# EAGLE schematic warp-revC (EAGLE 9.4.2)

## Sheet 1 of 2
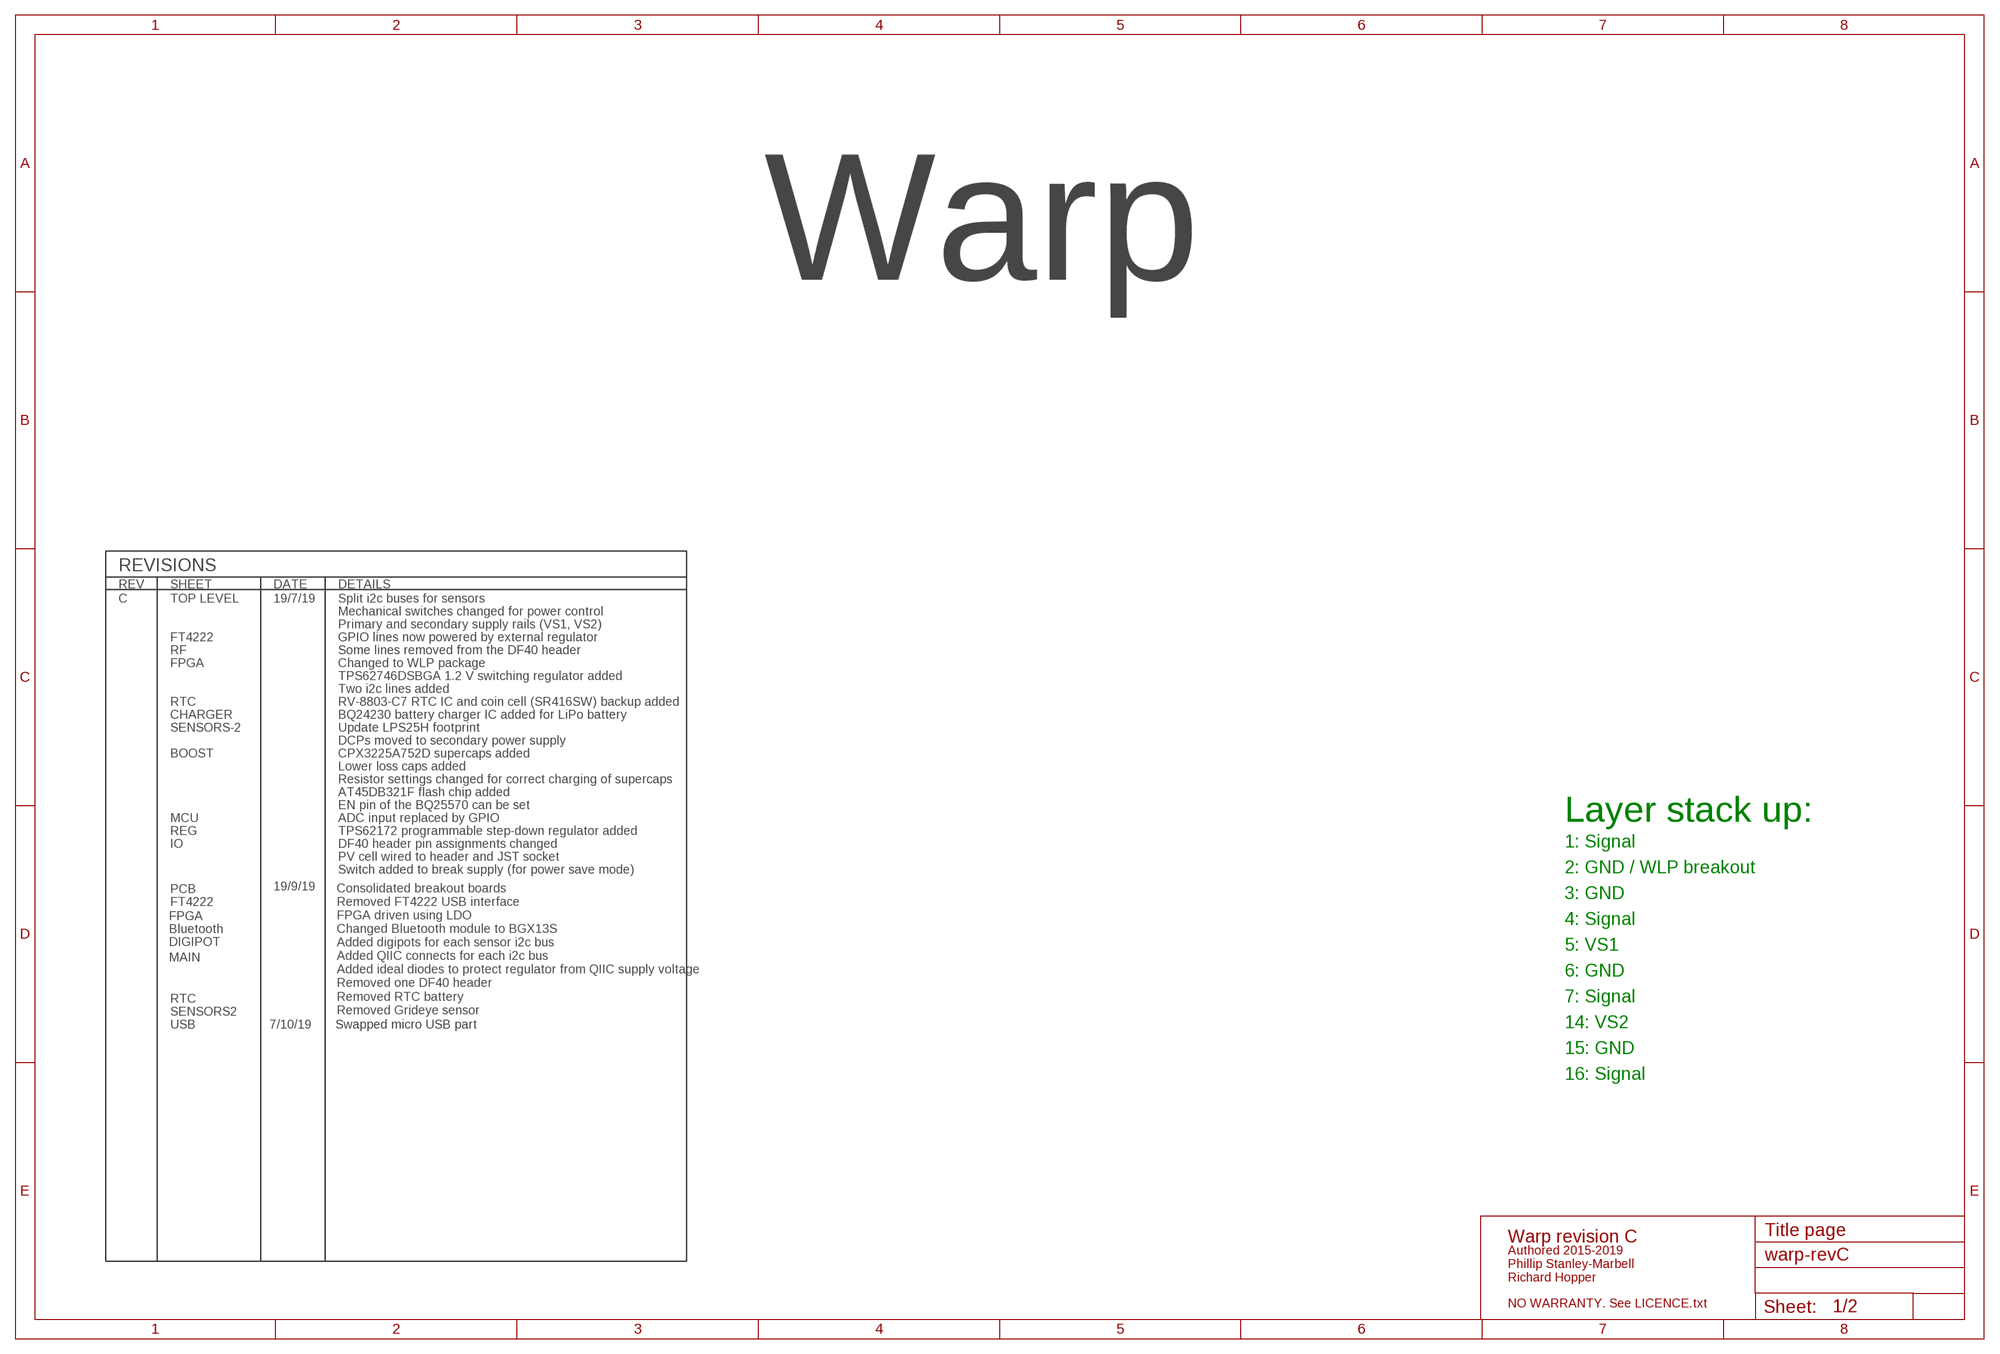
[diagram p0: schematic, sheet 1]

### Notes on the sheet
- Warp
- C | TOP LEVEL | 19/7/19 | Split i2c buses for sensors
- Mechanical switches changed for power control
- Primary and secondary supply rails (VS1, VS2)
- FT4222 | GPIO lines now powered by external regulator
- RF | Some lines removed from the DF40 header
- FPGA | Changed to WLP package
- TPS62746DSBGA 1.2 V switching regulator added
- Two i2c lines added
- RTC | RV-8803-C7 RTC IC and coin cell (SR416SW) backup added
- CHARGER | BQ24230 battery charger IC added for LiPo battery
- SENSORS-2 | Update LPS25H footprint
- DCPs moved to secondary power supply
- BOOST | CPX3225A752D supercaps added
- Lower loss caps added
- Resistor settings changed for correct charging of supercaps
- AT45DB321F flash chip added
- EN pin of the BQ25570 can be set
- MCU | ADC input replaced by GPIO | Layer stack up:
- REG | TPS62172 programmable step-down regulator added
- IO | DF40 header pin assignments changed | 1: Signal
- PV cell wired to header and JST socket
- Switch added to break supply (for power save mode) | 2: GND / WLP breakout
- PCB | 19/9/19
- 3: GND
- FT4222
- FPGA
- 4: Signal
- Bluetooth
- DIGIPOT
- 5: VS1
- MAIN
- 6: GND
- RTC | 7: Signal
- Consolidated breakout boards 
  Removed FT4222 USB interface 
  FPGA driven using LDO 
  Changed Bluetooth module to BGX13S 
  Added digipots for each sensor i2c bus 
  Added QIIC connects for each i2c bus 
  Added ideal diodes to protect regulator from QIIC supply voltage 
  Removed one DF40 header 
  Removed RTC battery 
  Removed Grideye sensor
- SENSORS2
- USB | 7/10/19 | Swapped micro USB part | 14: VS2
- 15: GND
- 16: Signal
- Title page
- Warp revision C
- Authored 2015-2019
  Phillip Stanley-Marbell
  Richard Hopper
- NO WARRANTY. See LICENCE.txt

## Sheet 2 of 2
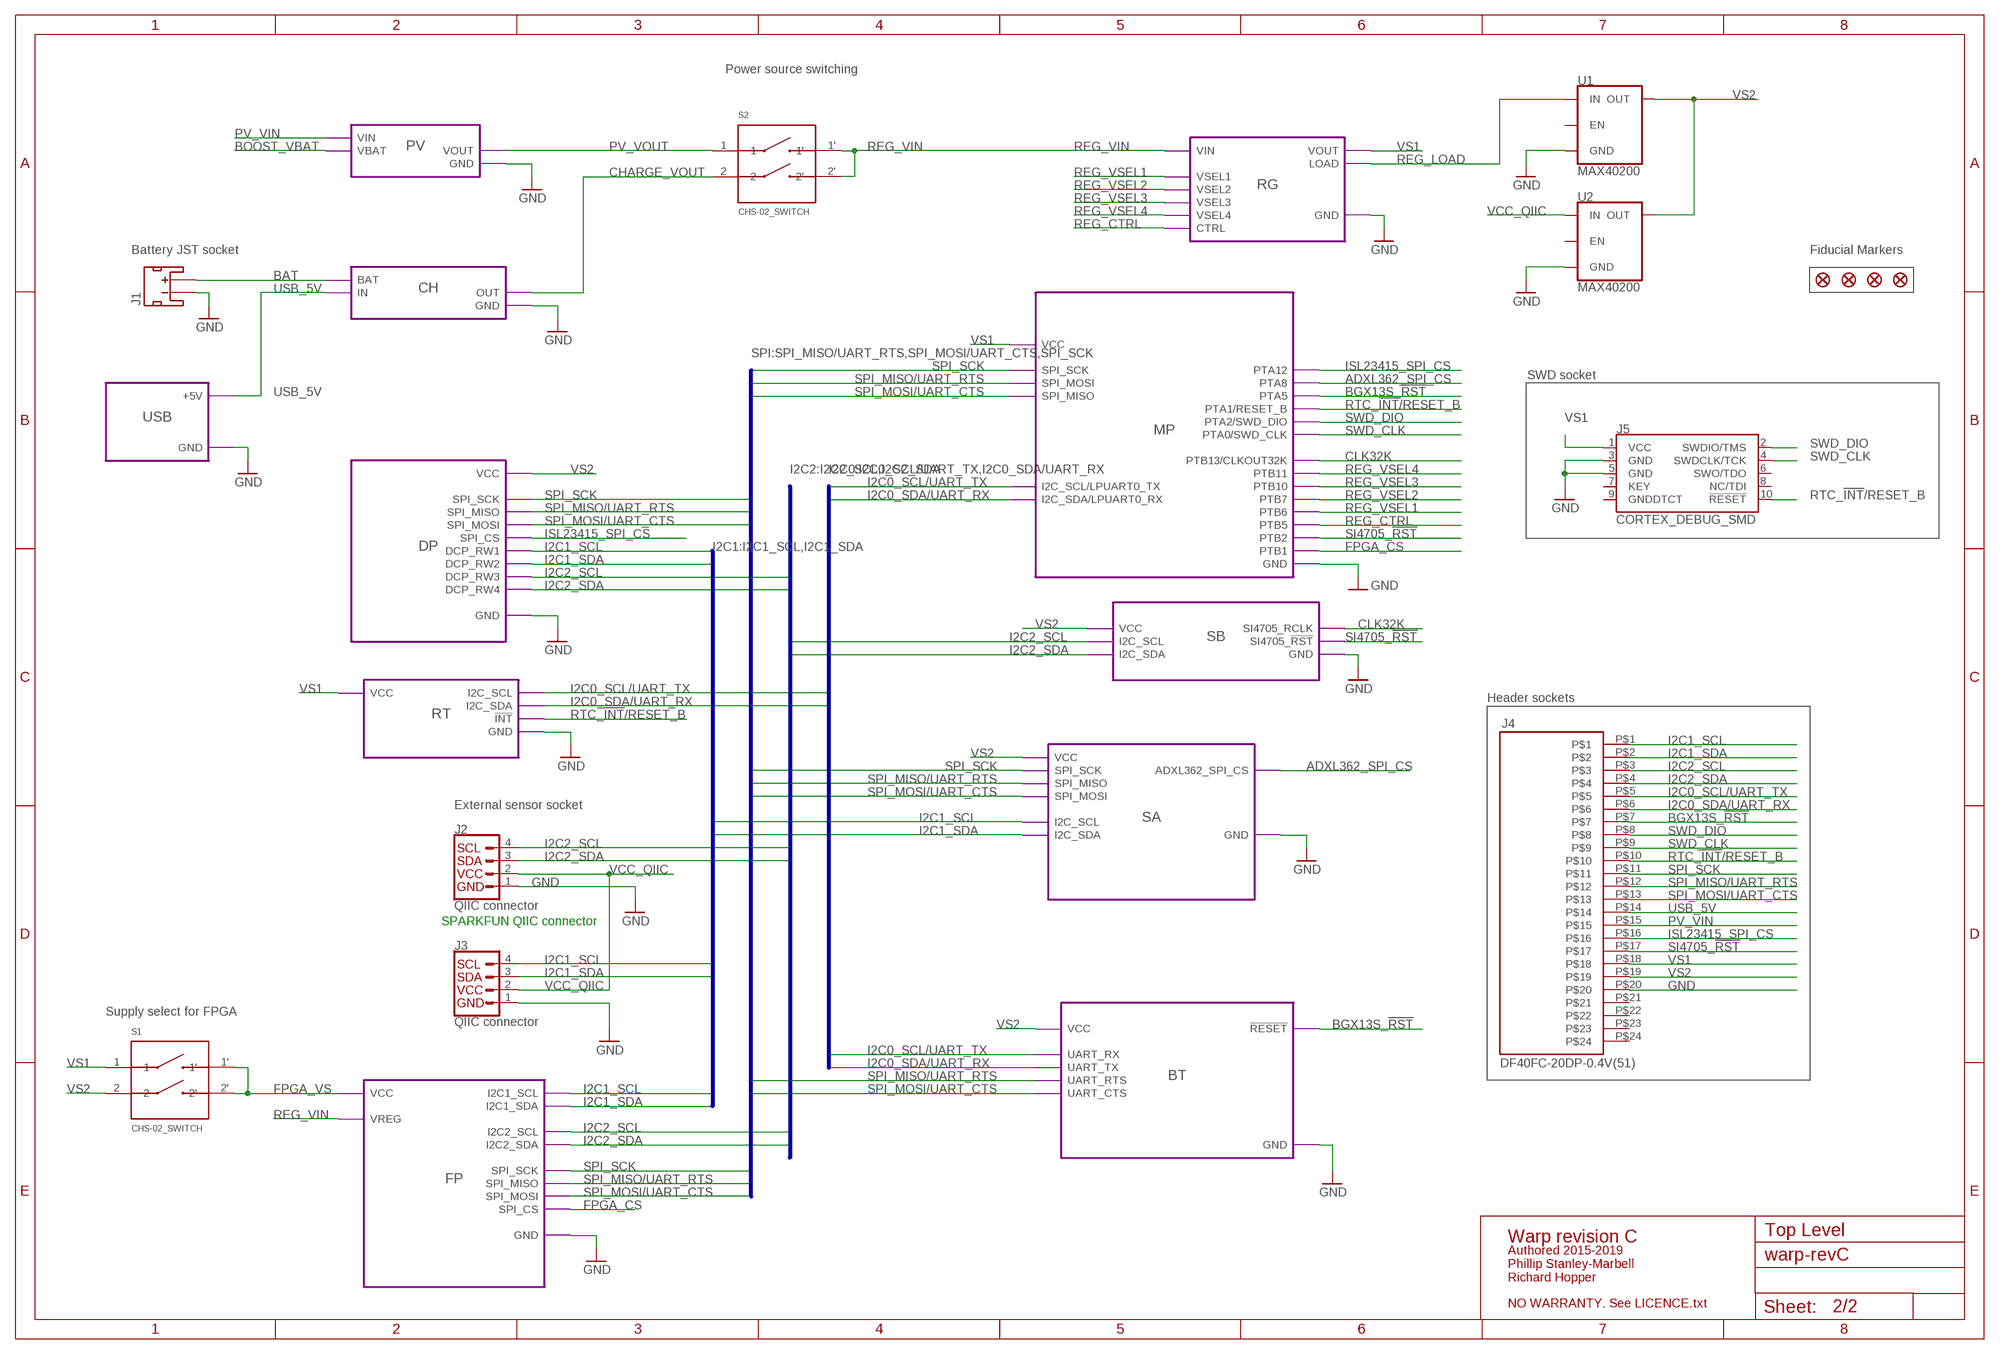
[diagram p1: schematic, sheet 2]

### Parts
FD1  FIDUCIAL1X2  [FIDUCIAL-1X2]
FD2  FIDUCIAL1X2  [FIDUCIAL-1X2]
FD3  FIDUCIAL1X2  [FIDUCIAL-1X2]
FD4  FIDUCIAL1X2  [FIDUCIAL-1X2]
J1  JST_2MM_MALE  [JST-2-SMD]
J2  QIIC connector  I2C_STANDARDJS-1MM  [1X04_1MM_RA]
J3  QIIC connector  I2C_STANDARDJS-1MM  [1X04_1MM_RA]
J4  DF40FC-20DP-0.4V(51)  [DF40C-20DP-0.4V(51)]
J5  CORTEX_DEBUG_SMD  [SAMTECH_FTSH-105-01]
S1  CHS-02_SWITCH  [CHS-02_SWITCH]
S2  CHS-02_SWITCH  [CHS-02_SWITCH]
U1  MAX40200  [DSBGA]
U2  MAX40200  [DSBGA]

### Module instances
PV = BOOSTER
MP = MPU
RG = REG
SA = SENSORS-1
FP = FPGA
SB = SENSORS-2
RT = RTC
CH = CHARGER
USB = USB
BT = BLUETOOTH
DP = DIGIPOT

### Nets
ADXL362_SPI_CS: port SA.ADXL362_SPI_CS MP.PTA8
BAT: J1.2(+) ; port CH.BAT
BGX13S_!RST: J4.P$7 ; port BT.!RESET MP.PTA5
BOOST_VBAT: port PV.VBAT
CHARGE_VOUT: S2.2 ; port CH.OUT
CLK32K: port MP.PTB13/CLKOUT32K SB.SI4705_RCLK
FPGA_CS: port FP.SPI_CS MP.PTB1
FPGA_VS: S1.1' S1.2' ; port FP.VCC
GND: J1.1(-) J2.1(GND) J3.1(GND) J4.P$20 J5.3(GND) J5.5(GND) U1.B2(GND) U2.B2(GND) ; port RG.GND PV.GND MP.GND SA.GND SB.GND FP.GND RT.GND CH.GND USB.GND BT.GND DP.GND
I2C0_SCL/UART_TX: J4.P$5 ; port MP.I2C_SCL/LPUART0_TX RT.I2C_SCL BT.UART_RX
I2C0_SDA/UART_RX: J4.P$6 ; port MP.I2C_SDA/LPUART0_RX RT.I2C_SDA BT.UART_TX
I2C1_SCL: J3.4(SCL) J4.P$1 ; port FP.I2C1_SCL SA.I2C_SCL DP.DCP_RW1
I2C1_SDA: J3.3(SDA) J4.P$2 ; port FP.I2C1_SDA SA.I2C_SDA DP.DCP_RW2
I2C2_SCL: J2.4(SCL) J4.P$3 ; port FP.I2C2_SCL DP.DCP_RW3 SB.I2C_SCL
I2C2_SDA: J2.3(SDA) J4.P$4 ; port FP.I2C2_SDA DP.DCP_RW4 SB.I2C_SDA
ISL23415_SPI_CS: J4.P$16 ; port MP.PTA12 DP.SPI_CS
PV_VIN: J4.P$15 ; port PV.VIN
PV_VOUT: S2.1 ; port PV.VOUT
REG_CTRL: port RG.CTRL MP.PTB5
REG_LOAD: U1.A1(IN) ; port RG.LOAD
REG_VIN: S2.1' S2.2' ; port RG.VIN FP.VREG
REG_VSEL1: port RG.VSEL1 MP.PTB6
REG_VSEL2: port RG.VSEL2 MP.PTB7
REG_VSEL3: port RG.VSEL3 MP.PTB10
REG_VSEL4: port RG.VSEL4 MP.PTB11
RTC_!INT!/RESET_B: J4.P$10 J5.10(!RESET) ; port MP.PTA1/RESET_B RT.!INT
SI4705_!RST: J4.P$17 ; port SB.SI4705_!RST MP.PTB2
SPI_MISO/UART_RTS: J4.P$12 ; port MP.SPI_MOSI SA.SPI_MISO FP.SPI_MISO BT.UART_RTS DP.SPI_MISO
SPI_MOSI/UART_CTS: J4.P$13 ; port SA.SPI_MOSI MP.SPI_MISO FP.SPI_MOSI BT.UART_CTS DP.SPI_MOSI
SPI_SCK: J4.P$11 ; port MP.SPI_SCK SA.SPI_SCK FP.SPI_SCK DP.SPI_SCK
SWD_CLK: J4.P$9 J5.4(SWDCLK/TCK) ; port MP.PTA0/SWD_CLK
SWD_DIO: J4.P$8 J5.2(SWDIO/TMS) ; port MP.PTA2/SWD_DIO
USB_5V: J4.P$14 ; port CH.IN USB.+5V
VCC_QIIC: J2.2(VCC) J3.2(VCC) U2.A1(IN)
VS1: J4.P$18 J5.1(VCC) S1.1 ; port MP.VCC RG.VOUT RT.VCC
VS2: J4.P$19 S1.2 U1.A2(OUT) U2.A2(OUT) ; port SA.VCC SB.VCC BT.VCC DP.VCC
Unconnected: J1.NC1(PAD1) J1.NC2(PAD2) J4.P$21 J4.P$22 J4.P$23 J4.P$24 J5.6(SWO/TDO) J5.7(KEY) J5.8(NC/TDI) J5.9(GNDDTCT) U1.B1(EN) U2.B1(EN)

### Buses
SPI:SPI_MISO/UART_RTS,SPI_MOSI/UART_CTS,SPI_SCK
I2C1:I2C1_SCL,I2C1_SDA
I2C2:I2C2_SCL,I2C2_SDA
I2C0:I2C0_SCL/UART_TX,I2C0_SDA/UART_RX

### Notes on the sheet
- Power source switching
- Battery JST socket | Fiducial Markers
- SWD socket
- Header sockets
- External sensor socket
- SPARKFUN QIIC connector
- Supply select for FPGA
- Top Level
- Warp revision C
- Authored 2015-2019
  Phillip Stanley-Marbell
  Richard Hopper
- NO WARRANTY. See LICENCE.txt

## Library data of the parts
FD1-FD4 = SparkFun-Aesthetics:FIDUCIAL: Fiducial Alignment Points Point-of-reference for pick-and-place machines and other optical instruments.
J1 = SparkFun-Connectors:JST_2MM_MALE: JST 2MM MALE RA CONNECTOR Two pin, compact surface mount connector. Commonly used as a battery input connection point. We really like the solid locking feeling and high current rating on these small connectors. We use these all the time as battery connectors. Mates to single-cell LiPo batteries. Here is the connector we sell at SparkFun: JST Right Angle Connector - White <https://www.sparkfun.com/products/8612> (PRT-08612) Datasheet <http://www.sparkfun.com/datasheets/Prototyping/Connectors/JST-Horizontal.pdf> It was used on these SparkFun products: SparkFun MOSFET Power Controller <https://www.sparkfun.com/products/11214> (PRT-11214) SparkFun Battery Babysitter - LiPo Battery Manager <https://www.sparkfun.com/products/13777> (PRT-13777) And many, many others that required a lipo battery connection.; PROD_ID: CONN-11443; SF_ID: PRT-08612
J2 J3 = SparkX:I2C_STANDARD: SparkFun I2C Standard Pinout Header SparkFun has standardized on a pinout for all I2C based sensor breakouts. This pinout allows I2C boards to be plugged directly into the headers on Arduino Uno compatible boards, and to be daisy chained easily. Example SparkFun Products: SparkFun Atmospheric Sensor Breakout - BME280 <https://www.sparkfun.com/products/13676> SparkFun Altitude/Pressure Sensor Breakout - MPL3115A2 <https://www.sparkfun.com/products/11084> SparkFun TOF Range Finder Sensor - VL6180 <https://www.sparkfun.com/products/12785>
J4 = DF40FC-20DP-0.4V(51):DF40FC-20DP-0.4V(51): DF40C-20DP-0.4V(51) Pins 21, 22, 23, and 24 (at the corners of the package) are not supposed to be used electrically. They have slightly wider pads. NOTE: The receptacles do not have connectors to the signals from these pins!
J5 = SparkFun-Connectors:CORTEX_DEBUG: Cortex Debug Connector - 10 pin Supports JTAG debug, Serial Wire debug, and Serial Wire Viewer. PTH and SMD connector options available. General Connector Information <http://infocenter.arm.com/help/topic/com.arm.doc.faqs/attached/13634/cortex_debug_connectors.pdf> Products: PTH Connector <http://www.digikey.com/product-detail/en/cnc-tech/3220-10-0100-00/1175-1627-ND/3883661> -via Digi-Key SparkFun PSoc <https://www.sparkfun.com/products/13229> SparkFun T <https://www.sparkfun.com/products/13810>
S1 S2 = CHS_SWITCH:CHS-02_SWITCH
U1 U2 = MAX40200:MAX40200

## Module BOOSTER
Ports: VIN(pwr) VOUT(pwr) VBAT(pwr) GND(pwr)
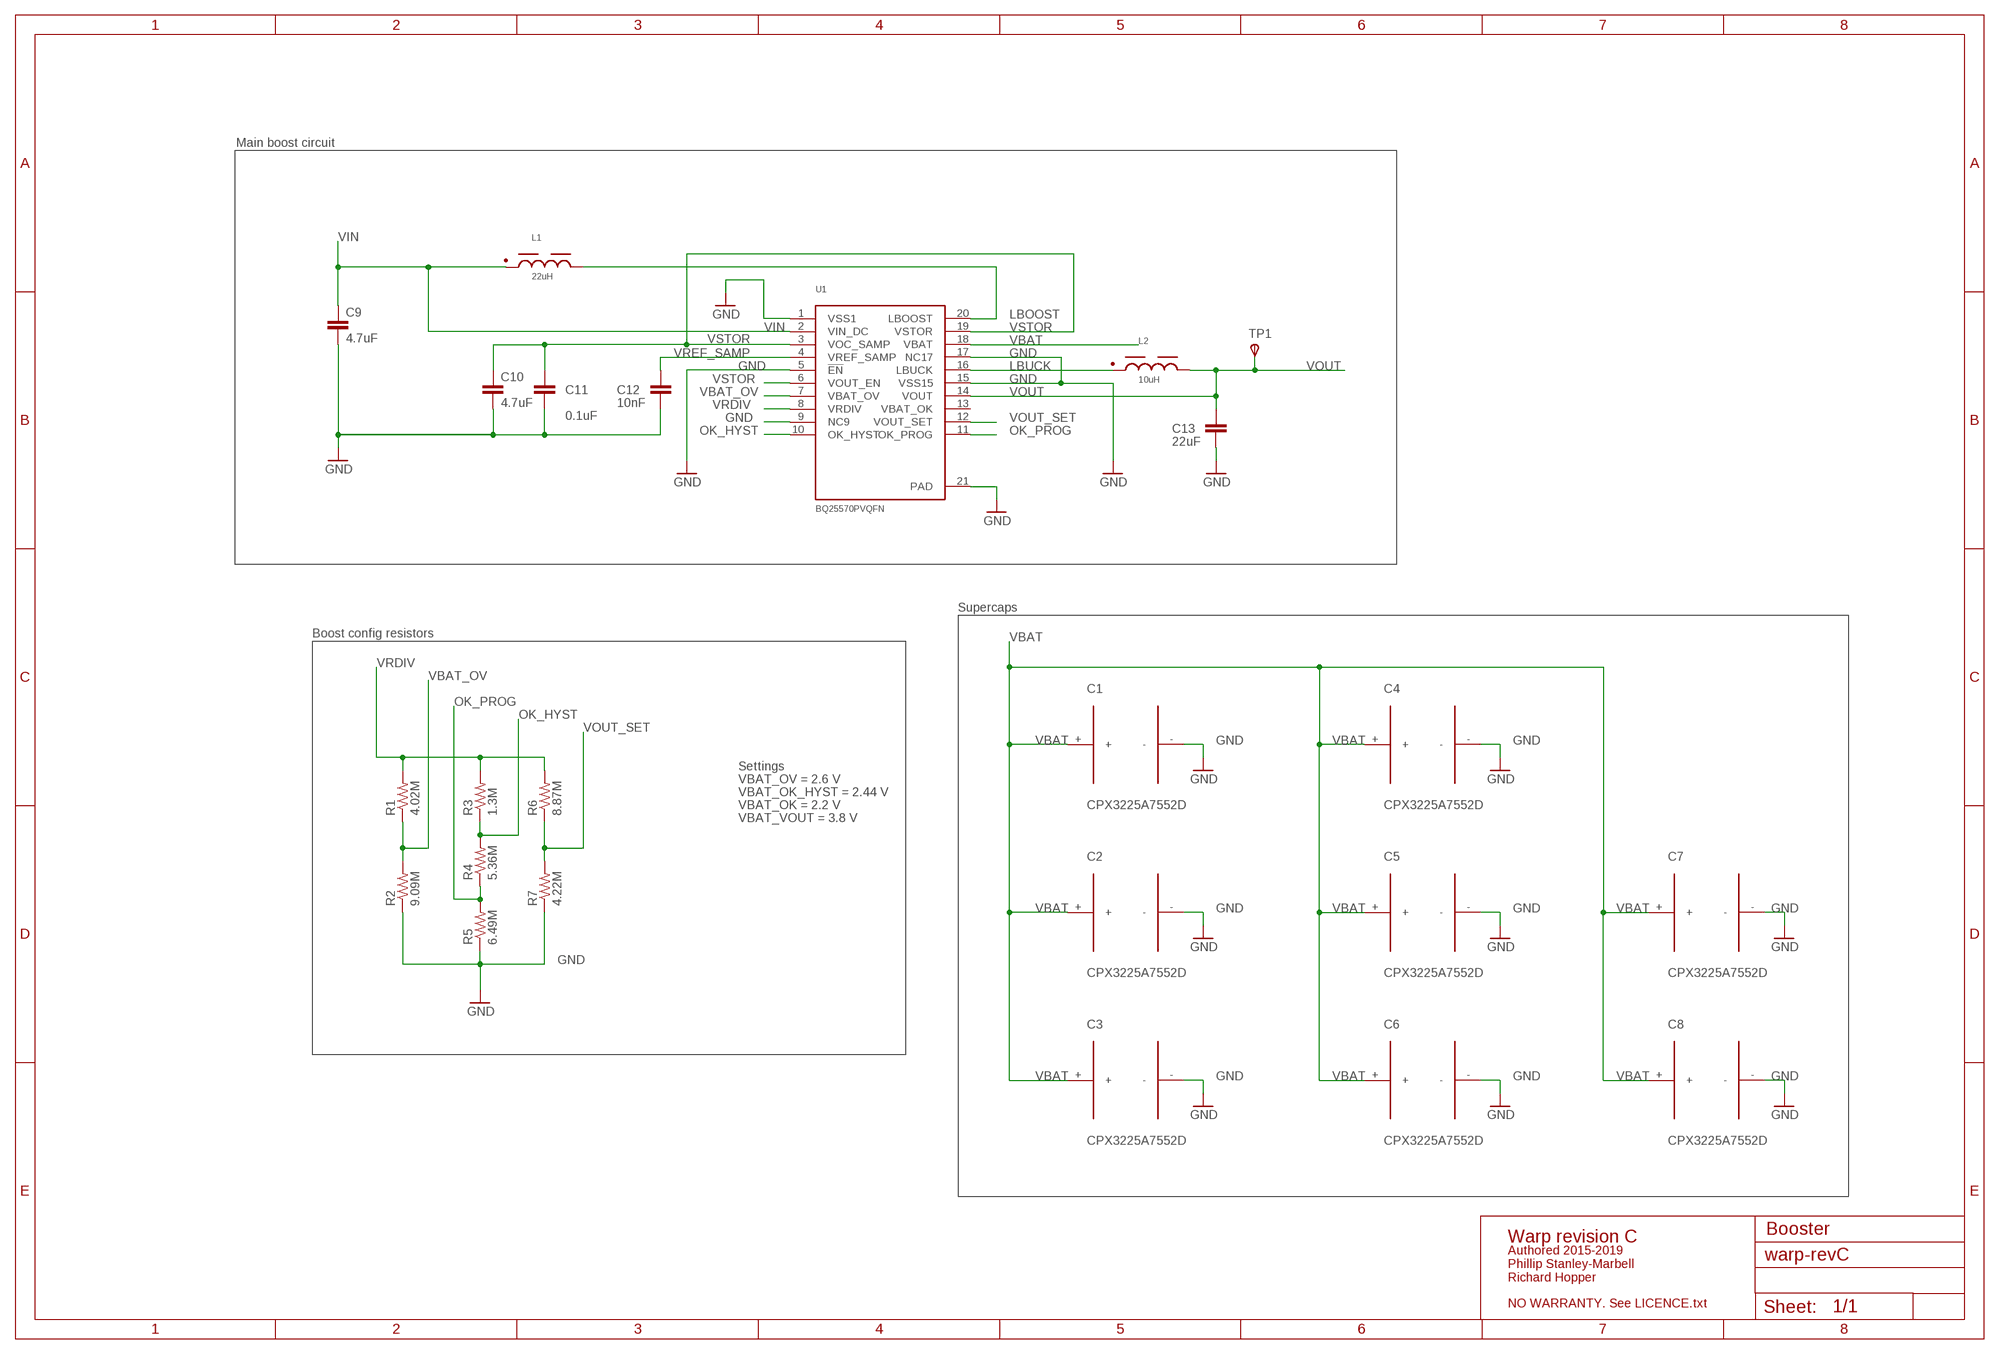
[diagram p2: schematic, module BOOSTER, sheet 1]

### Parts
C1  CPX3225A7552D  [CPX3225A752D]
C2  CPX3225A7552D  [CPX3225A752D]
C3  CPX3225A7552D  [CPX3225A752D]
C4  CPX3225A7552D  [CPX3225A752D]
C5  CPX3225A7552D  [CPX3225A752D]
C6  CPX3225A7552D  [CPX3225A752D]
C7  CPX3225A7552D  [CPX3225A752D]
C8  CPX3225A7552D  [CPX3225A752D]
C9  4.7uF  CAP0805  [0805]
C10  4.7uF  CAP0805  [0805]
C11  0.1uF  CAP0603-CAP  [0603-CAP]
C12  10nF  CAP0603-CAP  [0603-CAP]
C13  22uF  CAP0805  [0805]
L1  22uH  WE-TPC_3816_744031220  [WE-TPC_3816]
L2  10uH  WE-TPC_2813_744029100  [WE-TPC_2811/2813_OLD]
R1  4.02M  RESISTOR0402-RES  [0402-RES]
R2  9.09M  RESISTOR0402-RES  [0402-RES]
R3  1.3M  RESISTOR0402-RES  [0402-RES]
R4  5.36M  RESISTOR0402-RES  [0402-RES]
R5  6.49M  RESISTOR0402-RES  [0402-RES]
R6  8.87M  RESISTOR0402-RES  [0402-RES]
R7  4.22M  RESISTOR0402-RES  [0402-RES]
TP1  TPSTP06R  [TP06R]
U1  BQ25570PVQFN  [BQ25570]

### Nets
GND: C1.- C2.- C3.- C4.- C5.- C6.- C7.- C8.- C9.2 C10.2 C11.2 C12.2 C13.2 R2.1 R5.1 R7.1 U1.1(VSS1) U1.5(!EN) U1.9(NC9) U1.15(VSS15) U1.17(NC17) U1.21(PAD)
LBOOST: L1.2 U1.20(LBOOST)
LBUCK: L2.1 U1.16(LBUCK)
OK_HYST: R3.1 R4.2 U1.10(OK_HYST)
OK_PROG: R4.1 R5.2 U1.11(OK_PROG)
VBAT: C1.+ C2.+ C3.+ C4.+ C5.+ C6.+ C7.+ C8.+ U1.18(VBAT)
VBAT_OV: R1.1 R2.2 U1.7(VBAT_OV)
VIN: C9.1 L1.1 U1.2(VIN_DC)
VOUT: C13.1 L2.2 TP1.TP(PP) U1.14(VOUT)
VOUT_SET: R6.1 R7.2 U1.12(VOUT_SET)
VRDIV: R1.2 R3.2 R6.2 U1.8(VRDIV)
VREF_SAMP: C12.1 U1.4(VREF_SAMP)
VSTOR: C10.1 C11.1 U1.3(VOC_SAMP) U1.6(VOUT_EN) U1.19(VSTOR)
Unconnected: U1.13(VBAT_OK)

### Notes on the sheet
- Main boost circuit
- Supercaps
- Boost config resistors
- Settings
- VBAT_OV = 2.6 V
- VBAT_OK_HYST = 2.44 V
- VBAT_OK = 2.2 V
- VBAT_VOUT = 3.8 V
- Booster
- Warp revision C
- Authored 2015-2019
  Phillip Stanley-Marbell
  Richard Hopper
- NO WARRANTY. See LICENCE.txt

### Library data of the parts
C1-C7 = CPX3225A752D:CPX3225A7552D: CPX3225A eectric double layer capacitor
C8 = CPX3225A752D:CPX3225A7552D: CPX3225A eectric double layer capacitor; SPICEPREFIX: C
C9 C10 = SparkFun-Passives:CAP: Capacitor Standard 0603 ceramic capacitor, and 0.1" leaded capacitor.; PN: C0805C475K9RACTU
C11 = SparkFun-Passives:CAP: Capacitor Standard 0603 ceramic capacitor, and 0.1" leaded capacitor.; PN: 02016D104KAT2A
C12 = SparkFun-Passives:CAP: Capacitor Standard 0603 ceramic capacitor, and 0.1" leaded capacitor.; PN: GRM188R71H103KA01D
C13 = SparkFun-Passives:CAP: Capacitor Standard 0603 ceramic capacitor, and 0.1" leaded capacitor.; PN: JMK212BJ226KG-T
L1 = EMCComponents (rev19c):WE-TPC_3816: SMD Shielded Tiny Power Inductor Characteristics Extremely flat power inductor High current capability Magnetically shielded which results in a low leakage field Operating temperature: –40 °C to +125 °C Applications Portable power like PDA, digital camera, PCMCIA cards and displays DC/DC converter Embedded PC Mobile data gathering, telemetric <http://katalog.we-online.de/media/images/v2/WE-TPC_Gruppe_2.jpg> Details see: http://katalog.we-online.de/en/pbs/WE-TPC? Updated by Dan Xu 2014-07-11 2014 (C) Wurth Elektronik; WE-NUMBER: 744031220/22uH
L2 = EMCComponents (rev19c):WE-TPC_2813: SMD Shielded Tiny Power Inductor Characteristics Extremely flat power inductor High current capability Magnetically shielded which results in a low leakage field Operating temperature: –40 °C to +125 °C Applications Portable power like PDA, digital camera, PCMCIA cards and displays DC/DC converter Embedded PC Mobile data gathering, telemetric <http://katalog.we-online.de/media/images/v2/WE-TPC_Gruppe_2.jpg> Details see: http://katalog.we-online.de/en/pbs/WE-TPC? Updated by Dan Xu 2014-07-11 2014 (C) Wurth Elektronik; WE-NUMBER: 744029100/10uH
R1-R7 = SparkFun-Passives:RESISTOR: Resistor Basic schematic elements and footprints for 0603, 1206, and PTH resistors.
TP1 = testpad:TPS: TEST PIN
U1 = BQ25570:BQ25570

## Module MPU
Ports: GND(pwr) VCC(pwr) PTB1(io) PTB2(io) PTB5(io) PTB6(io) PTB7(io) PTA8(io) PTA5(io) PTB10(io) PTA12(io) PTB11(io) PTB13/CLKOUT32K(io) SPI_SCK(out) SPI_MISO(io) SPI_MOSI(out) I2C_SCL/LPUART0_TX(out) I2C_SDA/LPUART0_RX(io) PTA1/RESET_B(io) PTA2/SWD_DIO(io) PTA0/SWD_CLK(io)
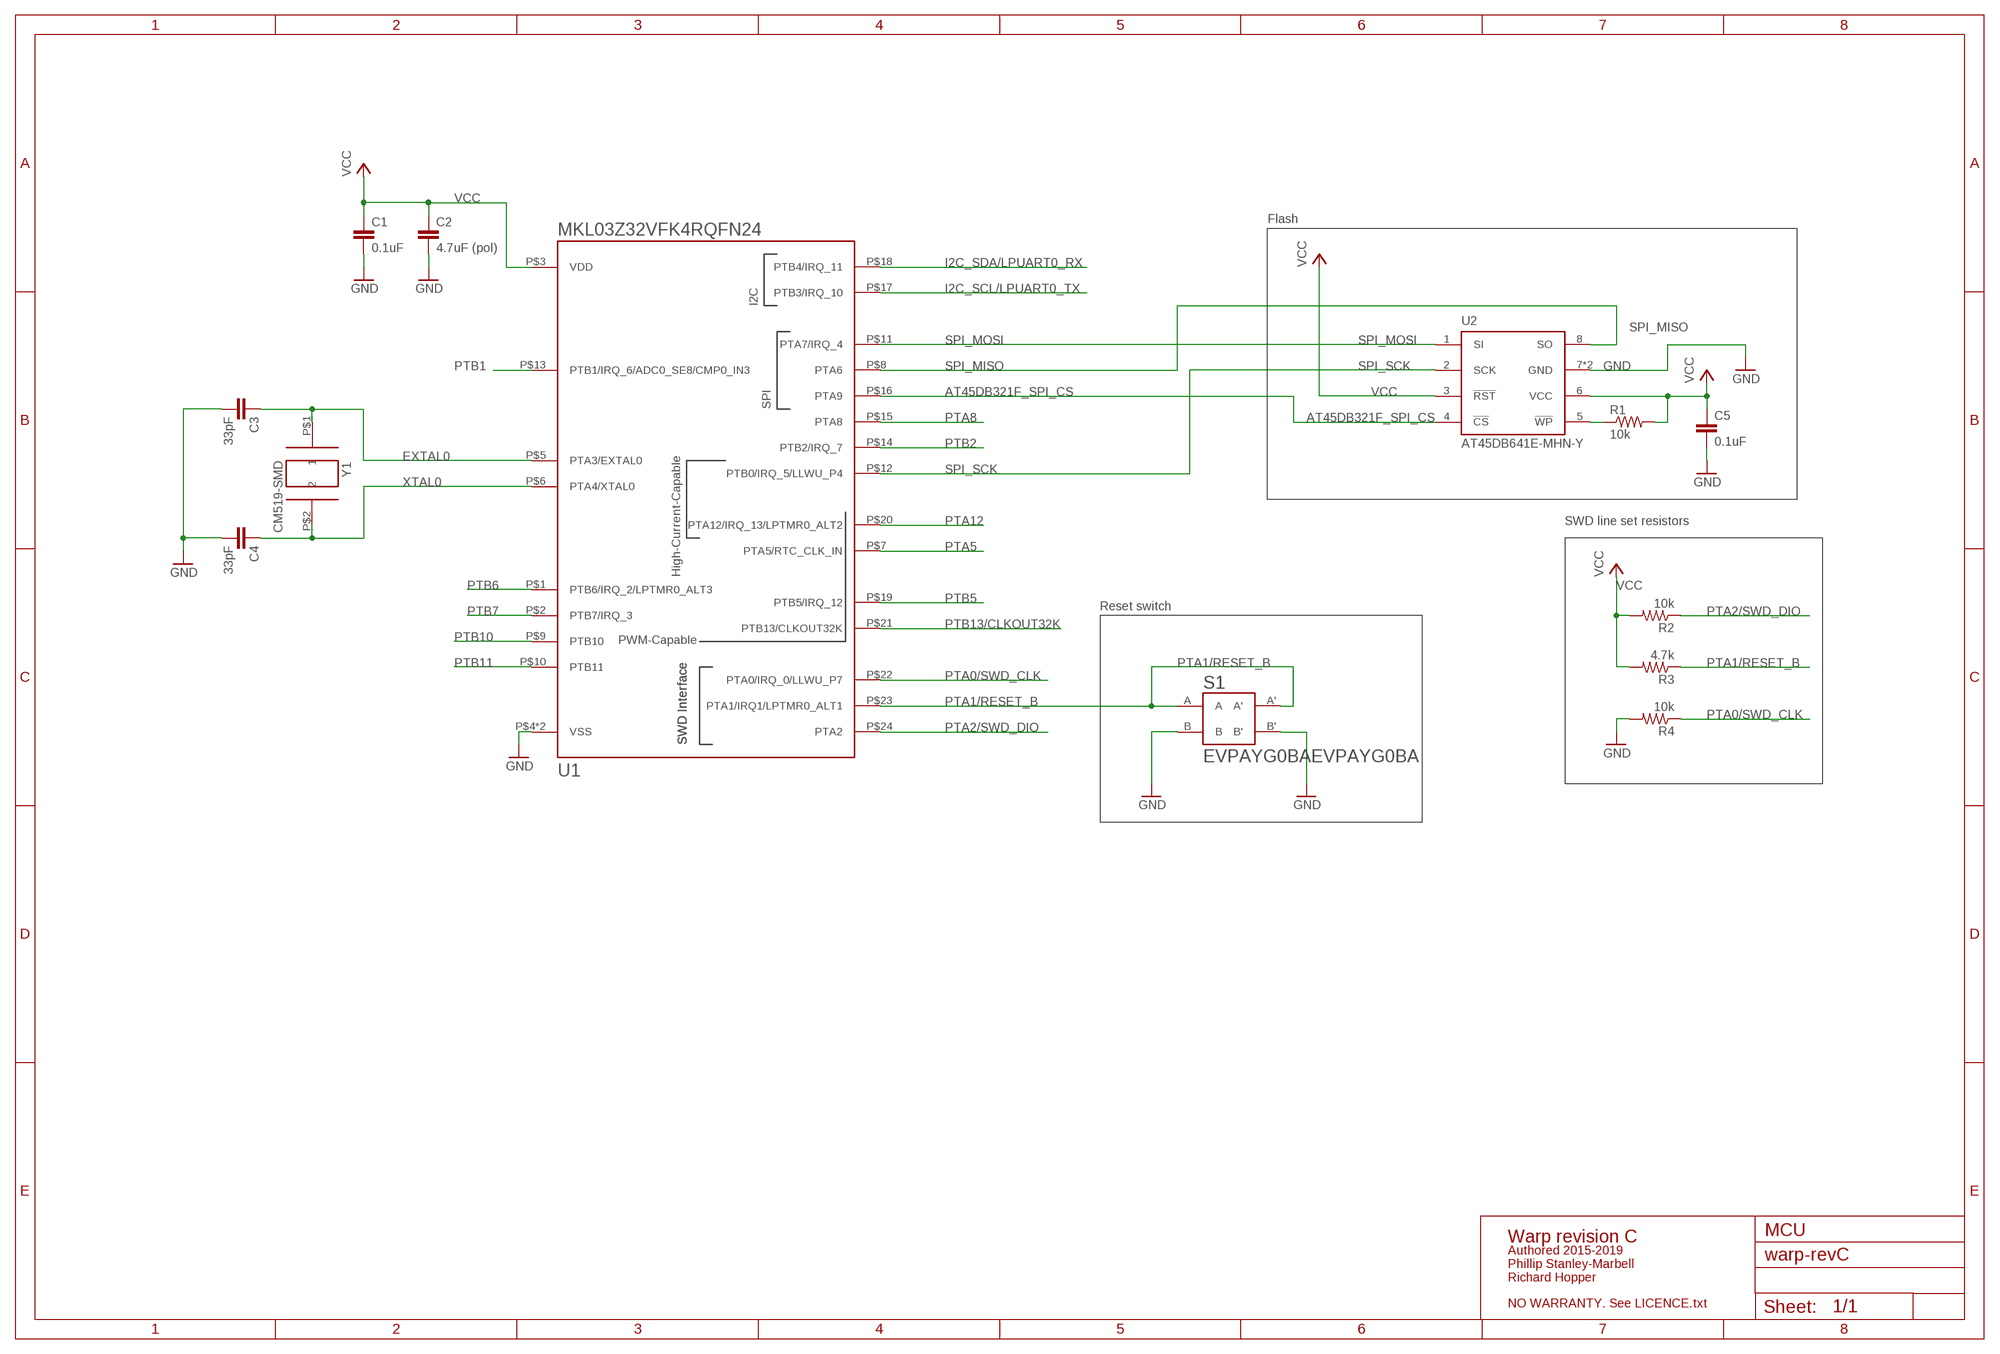
[diagram p3: schematic, module MPU, sheet 1]

### Parts
C1  0.1uF  CAP0402-CAP  [0402-CAP]
C2  4.7uF (pol)  CAP0402-CAP  [0402-CAP]
C3  33pF  CAP0402-CAP  [0402-CAP]
C4  33pF  CAP0402-CAP  [0402-CAP]
C5  0.1uF  CAP0402-CAP  [0402-CAP]
R1  10k  RESISTOR0402-RES  [0402-RES]
R2  10k  RESISTOR0402-RES  [0402-RES]
R3  4.7k  RESISTOR0402-RES  [0402-RES]
R4  10k  RESISTOR0402-RES  [0402-RES]
S1  EVPAYG0BAEVPAYG0BA  [EVPAYG0BA]
U1  MKL03Z32VFK4RQFN24  [MKL03Z32VFK4R]
U2  AT45DB641E-MHN-Y  [UDFN]
Y1  CM519-SMD  [CM519]

### Nets
AT45DB321F_SPI_CS: U1.P$16(PTA9) U2.4(!CS!)
EXTAL0: C3.1 U1.P$5(PTA3/EXTAL0) Y1.P$1
GND: C1.2 C2.2 C3.2 C4.2 C5.2 R4.2 S1.B S1.B' U1.P$4(VSS) U1.P$PAD(VSS) U2.7(GND) U2.9(GND)
I2C_SCL/LPUART0_TX: U1.P$17(PTB3/IRQ_10)
I2C_SDA/LPUART0_RX: U1.P$18(PTB4/IRQ_11)
N$4: R1.1 U2.5(!WP!)
PTA0/SWD_CLK: R4.1 U1.P$22(PTA0/IRQ_0/LLWU_P7)
PTA1/RESET_B: R3.1 S1.A S1.A' U1.P$23(PTA1/IRQ1/LPTMR0_ALT1)
PTA2/SWD_DIO: R2.1 U1.P$24(PTA2)
PTA5: U1.P$7(PTA5/RTC_CLK_IN)
PTA8: U1.P$15(PTA8)
PTA12: U1.P$20(PTA12/IRQ_13/LPTMR0_ALT2)
PTB1: U1.P$13(PTB1/IRQ_6/ADC0_SE8/CMP0_IN3)
PTB2: U1.P$14(PTB2/IRQ_7)
PTB5: U1.P$19(PTB5/IRQ_12)
PTB6: U1.P$1(PTB6/IRQ_2/LPTMR0_ALT3)
PTB7: U1.P$2(PTB7/IRQ_3)
PTB10: U1.P$9(PTB10)
PTB11: U1.P$10(PTB11)
PTB13/CLKOUT32K: U1.P$21(PTB13/CLKOUT32K)
SPI_MISO: U1.P$8(PTA6) U2.8(SO)
SPI_MOSI: U1.P$11(PTA7/IRQ_4) U2.1(SI)
SPI_SCK: U1.P$12(PTB0/IRQ_5/LLWU_P4) U2.2(SCK)
VCC: C1.1 C2.1 C5.1 R1.2 R2.2 R3.2 U1.P$3(VDD) U2.3(!RST!) U2.6(VCC)
XTAL0: C4.1 U1.P$6(PTA4/XTAL0) Y1.P$2

### Notes on the sheet
- Flash
- SWD line set resistors
- Reset switch
- MCU
- Warp revision C
- Authored 2015-2019
  Phillip Stanley-Marbell
  Richard Hopper
- NO WARRANTY. See LICENCE.txt

### Library data of the parts
C1-C5 = SparkFun-Passives:CAP: Capacitor Standard 0603 ceramic capacitor, and 0.1" leaded capacitor.
R1-R4 = SparkFun-Passives:RESISTOR: Resistor Basic schematic elements and footprints for 0603, 1206, and PTH resistors.
S1 = EVPAYG0BA:EVPAYG0BA
U1 = MKL03Z32VFK4R:MKL03Z32VFK4R: Kinetis KL03 32 KB Flash, 48 MHz Cortex-M0+ Microcontroller, in 24 pin QFN package (MKL03Z32VFK4R). The package for the 20 pin WLCSP (MKL03Z32CAF4R) is also in the library due to historical reasons. Can't yet figure out how to remove it.
U2 = AT45D_Flash:AT45DB641E-MHN-Y: AT45DB321FLow-Power 32 Mbit, 1.65V - 3.6V SPI Serial DataFlashMemory with 512/528 Byte Page Size
Y1 = CM519:CM519

## Module REG
Ports: GND(pwr) VIN(pwr) VOUT(pwr) LOAD(pwr) CTRL(in) VSEL1(in) VSEL2(in) VSEL3(in) VSEL4(in)
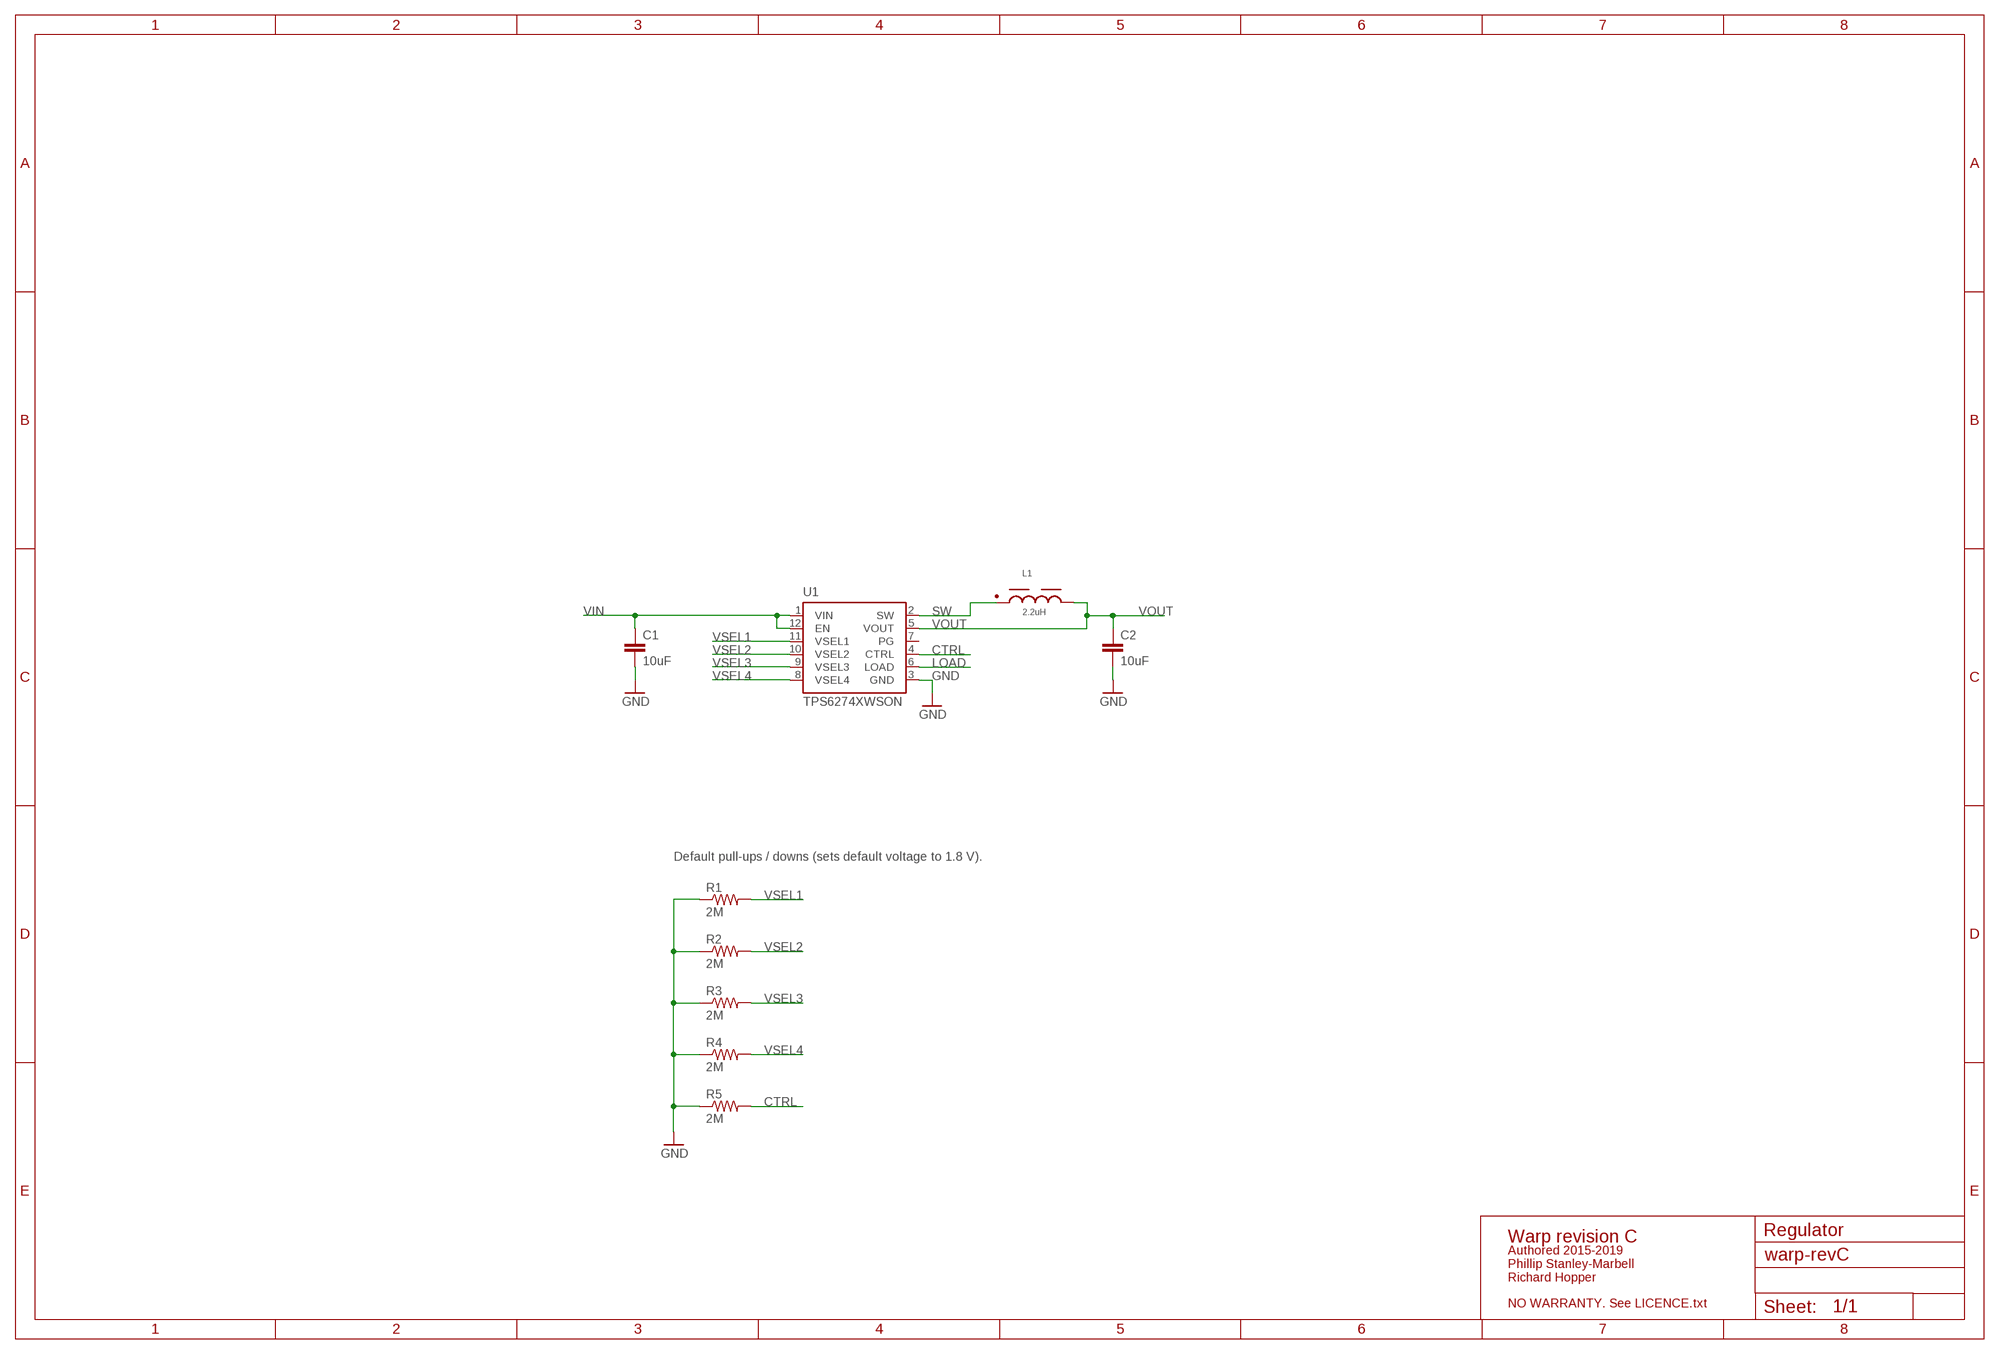
[diagram p4: schematic, module REG, sheet 1]

### Parts
C1  10uF  CAP0805  [0805]
C2  10uF  CAP0805  [0805]
L1  2.2uH  WE-TPC_2828_744025002  [WE-TPC_2828_OLD]
R1  2M  RESISTOR0402-RES  [0402-RES]
R2  2M  RESISTOR0402-RES  [0402-RES]
R3  2M  RESISTOR0402-RES  [0402-RES]
R4  2M  RESISTOR0402-RES  [0402-RES]
R5  2M  RESISTOR0402-RES  [0402-RES]
U1  TPS6274XWSON  [WSON-12]

### Nets
CTRL: R5.2 U1.4(CTRL)
GND: C1.2 C2.2 R1.1 R2.1 R3.1 R4.1 R5.1 U1.3(GND)
LOAD: U1.6(LOAD)
SW: L1.1 U1.2(SW)
VIN: C1.1 U1.1(VIN) U1.12(EN)
VOUT: C2.1 L1.2 U1.5(VOUT)
VSEL1: R1.2 U1.11(VSEL1)
VSEL2: R2.2 U1.10(VSEL2)
VSEL3: R3.2 U1.9(VSEL3)
VSEL4: R4.2 U1.8(VSEL4)
Unconnected: U1.7(PG)

### Notes on the sheet
- Default pull-ups / downs (sets default voltage to 1.8 V).
- Regulator
- Warp revision C
- Authored 2015-2019
  Phillip Stanley-Marbell
  Richard Hopper
- NO WARRANTY. See LICENCE.txt

### Library data of the parts
C1 C2 = SparkFun-Passives:CAP: Capacitor Standard 0603 ceramic capacitor, and 0.1" leaded capacitor.
L1 = EMCComponents (rev19c):WE-TPC_2828: SMD Shielded Tiny Power Inductor Characteristics Extremely flat power inductor High current capability Magnetically shielded which results in a low leakage field Operating temperature: –40 °C to +125 °C Applications Portable power like PDA, digital camera, PCMCIA cards and displays DC/DC converter Embedded PC Mobile data gathering, telemetric <http://katalog.we-online.de/media/images/v2/WE-TPC_Gruppe_2.jpg> Details see: http://katalog.we-online.de/en/pbs/WE-TPC? Updated by Dan Xu 2014-07-11 2014 (C) Wurth Elektronik; WE-NUMBER: 744025002/2,2uH
R1-R5 = SparkFun-Passives:RESISTOR: Resistor Basic schematic elements and footprints for 0603, 1206, and PTH resistors.
U1 = TPS6274x:TPS6274X

## Module BLUETOOTH
Ports: GND(pwr) VCC(pwr) UART_RX(in) UART_TX(out) UART_CTS(io) UART_RTS(io) !RESET(in)
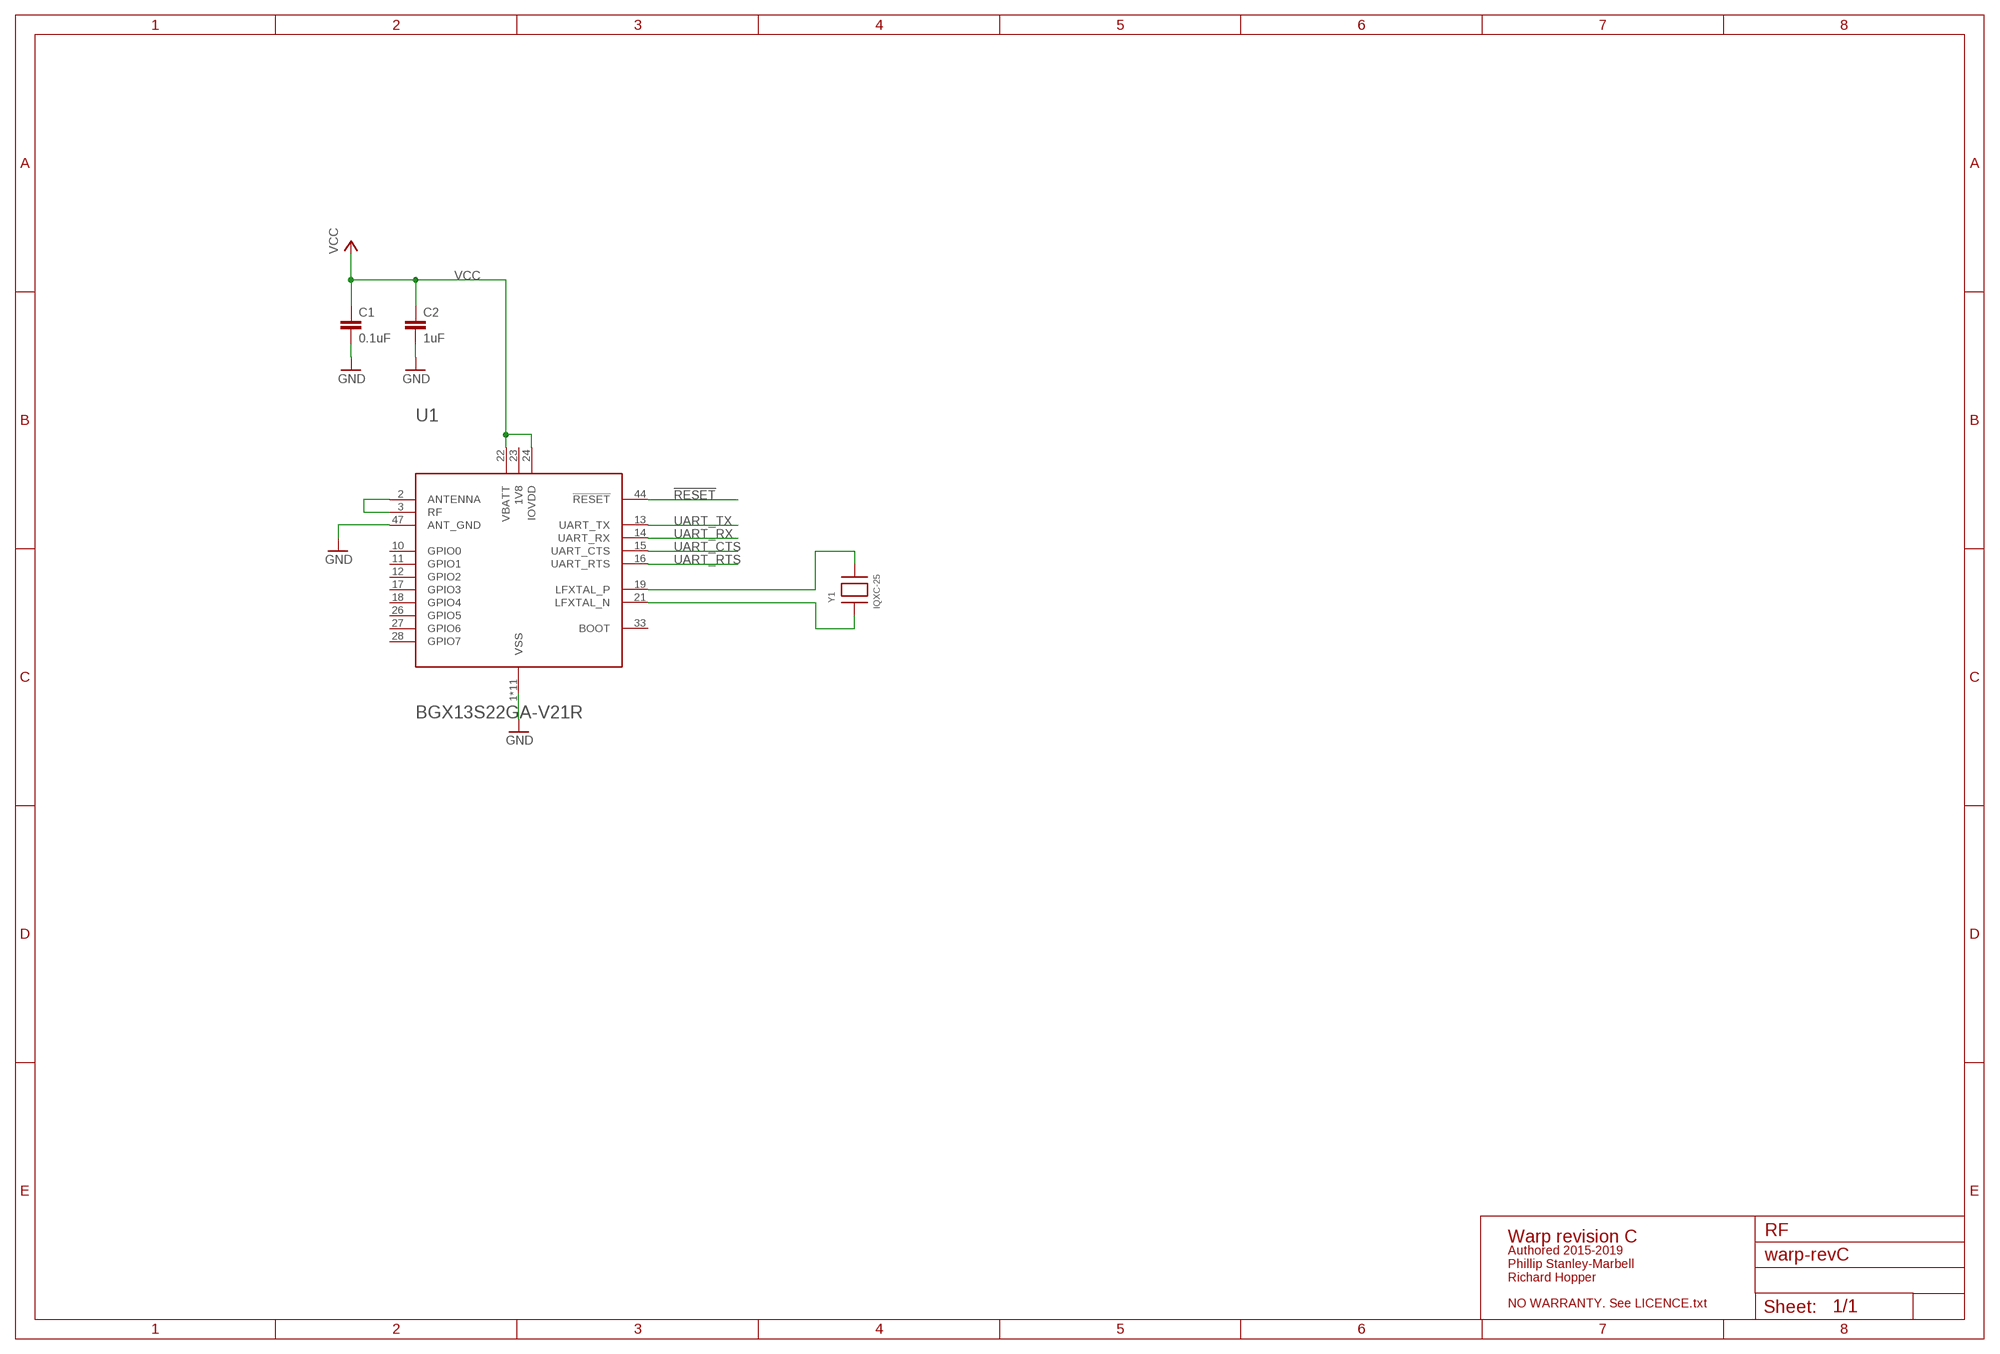
[diagram p5: schematic, module BLUETOOTH, sheet 1]

### Parts
C1  0.1uF  CAP0402-CAP  [0402-CAP]
C2  1uF  CAP0402-CAP  [0402-CAP]
U1  BGX13S22GA-V21R  [BGX13S]
Y1  IQXC-25  [IQXC-25]

### Nets
!RESET: U1.44(!RESET)
GND: C1.2 C2.2 U1.1(VSS) U1.4(VSS) U1.5(VSS) U1.20(VSS) U1.31(VSS) U1.45(VSS) U1.46(VSS) U1.47(ANT_GND) U1.48(VSS) U1.49(VSS) U1.50(VSS) U1.51(VSS)
N$1: U1.21(LFXTAL_N) Y1.1
N$2: U1.19(LFXTAL_P) Y1.2
N$3: U1.2(ANTENNA) U1.3(RF)
UART_CTS: U1.15(UART_CTS)
UART_RTS: U1.16(UART_RTS)
UART_RX: U1.14(UART_RX)
UART_TX: U1.13(UART_TX)
VCC: C1.1 C2.1 U1.22(VBATT) U1.24(IOVDD)
Unconnected: U1.10(GPIO0) U1.11(GPIO1) U1.12(GPIO2) U1.17(GPIO3) U1.18(GPIO4) U1.23(1V8) U1.26(GPIO5) U1.27(GPIO6) U1.28(GPIO7) U1.33(BOOT)

### Notes on the sheet
- RF
- Warp revision C
- Authored 2015-2019
  Phillip Stanley-Marbell
  Richard Hopper
- NO WARRANTY. See LICENCE.txt

### Library data of the parts
C1 C2 = SparkFun-Passives:CAP: Capacitor Standard 0603 ceramic capacitor, and 0.1" leaded capacitor.
U1 = BGX13S:BGX13S22GA-V21R
Y1 = IQXC-25:IQXC-25

## Module SENSORS-1
Ports: GND(pwr) I2C_SCL(in) I2C_SDA(io) ADXL362_SPI_CS(in) SPI_SCK(in) SPI_MISO(out) SPI_MOSI(in) VCC(pwr)
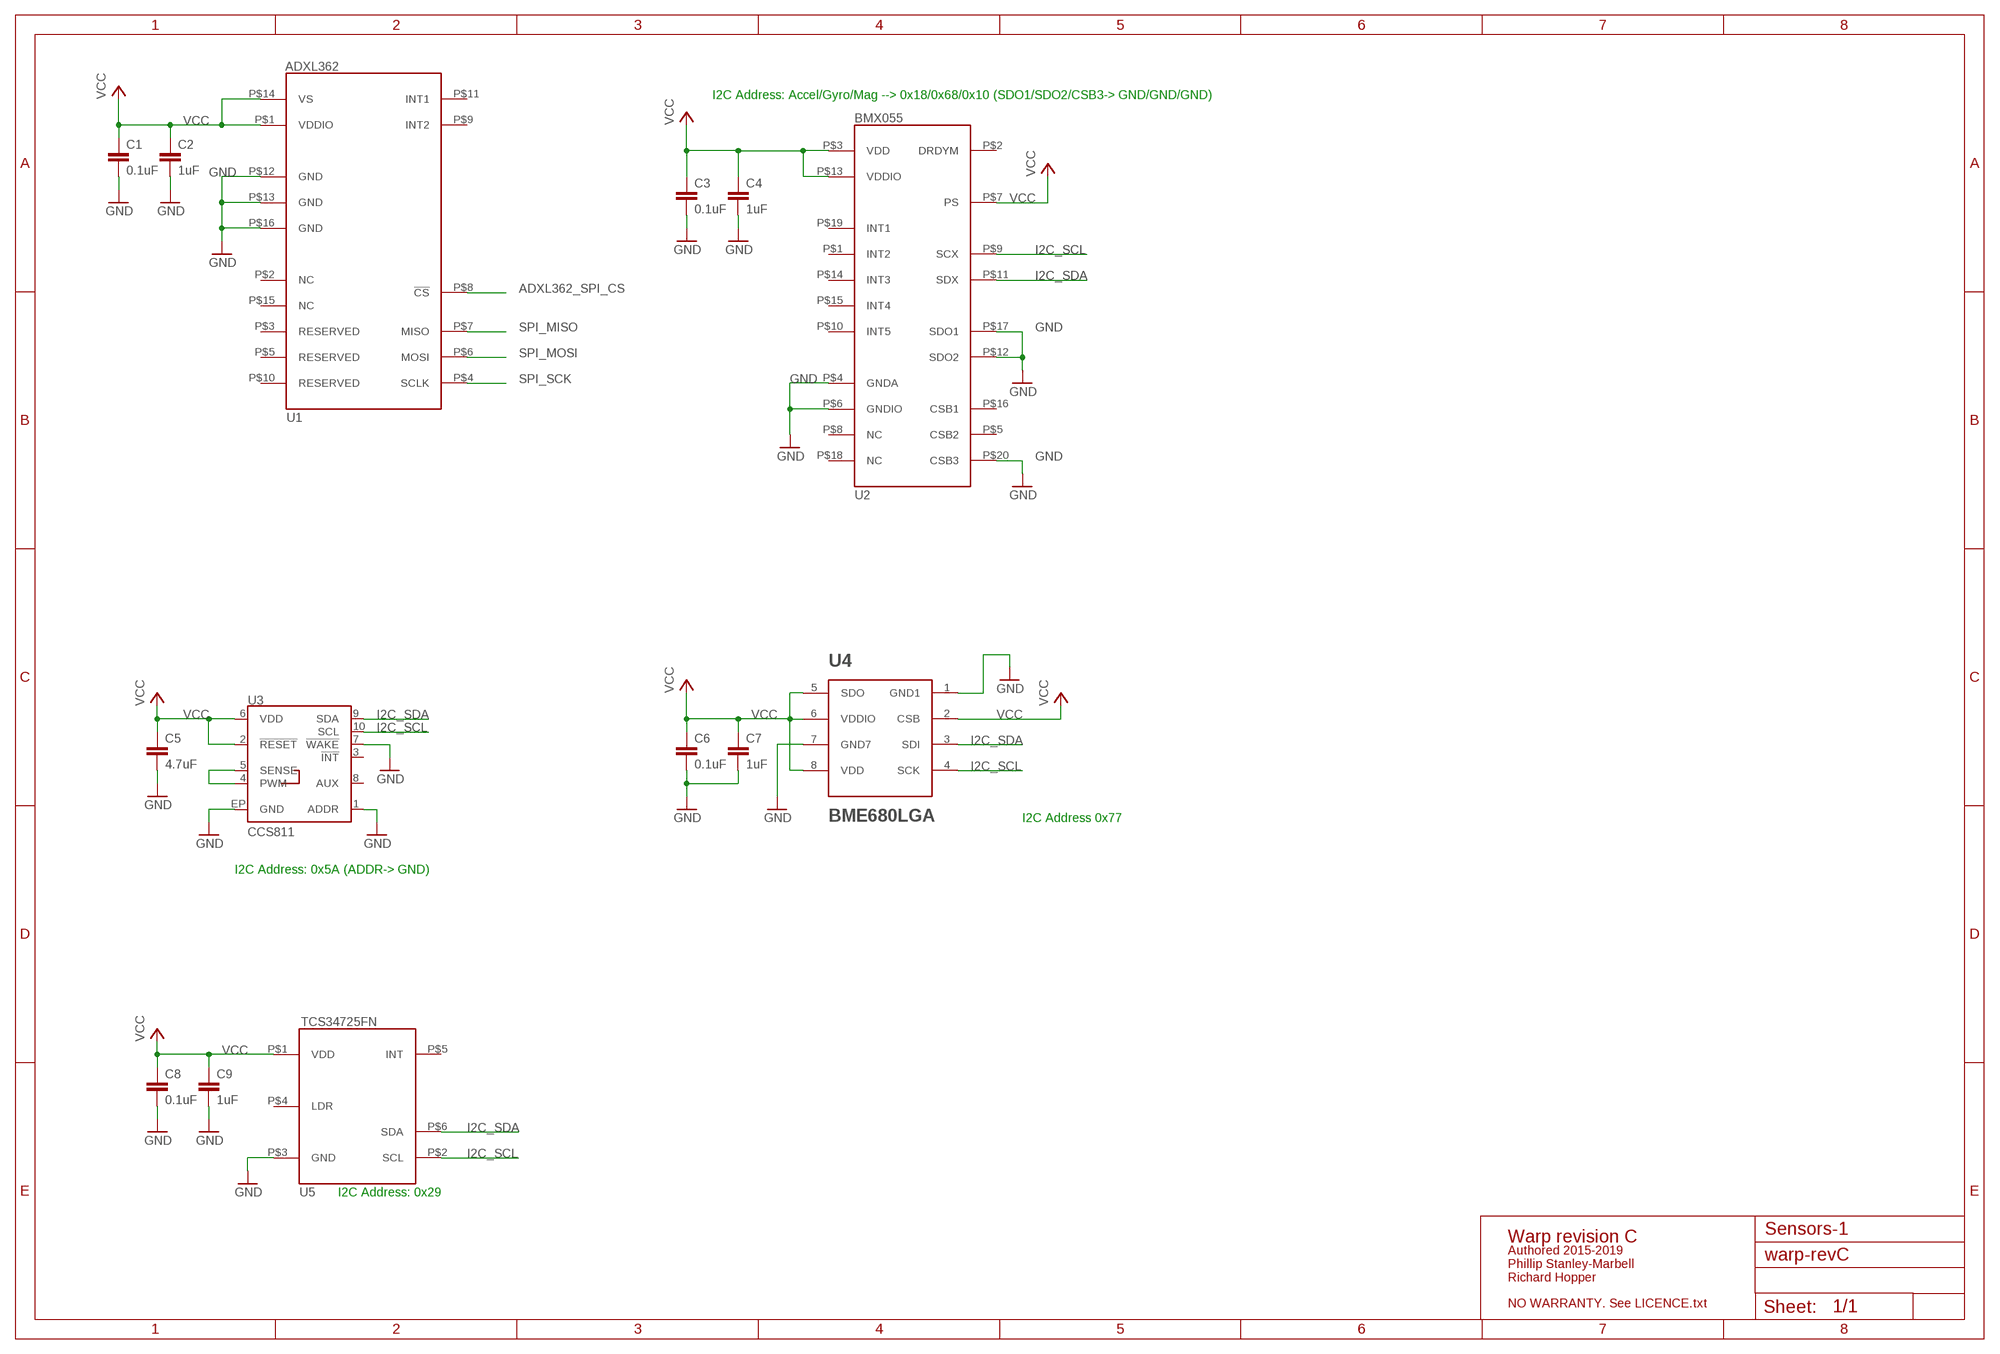
[diagram p6: schematic, module SENSORS-1, sheet 1]

### Parts
C1  0.1uF  CAP0402-CAP  [0402-CAP]
C2  1uF  CAP0402-CAP  [0402-CAP]
C3  0.1uF  CAP0402-CAP  [0402-CAP]
C4  1uF  CAP0402-CAP  [0402-CAP]
C5  4.7uF  CAP0402-CAP  [0402-CAP]
C6  0.1uF  CAP0402-CAP  [0402-CAP]
C7  1uF  CAP0402-CAP  [0402-CAP]
C8  0.1uF  CAP0402-CAP  [0402-CAP]
C9  1uF  CAP0402-CAP  [0402-CAP]
U1  ADXL362  [ADXL362]
U2  BMX055  [BMX055]
U3  CCS811  CCS811PRODUCTION  [LGA10]
U4  BME680LGA  [BME680]
U5  TCS34725FN  TCS3772  [TCS3772]

### Nets
ADXL362_SPI_CS: U1.P$8(!CS)
GND: C1.2 C2.2 C3.2 C4.2 C5.2 C6.2 C7.2 C8.2 C9.2 U1.P$12(GND) U1.P$13(GND) U1.P$16(GND) U2.P$4(GNDA) U2.P$6(GNDIO) U2.P$12(SDO2) U2.P$17(SDO1) U2.P$20(CSB3) U3.1(ADDR) U3.7(!WAKE!) U3.EP(GND) U4.1(GND1) U4.7(GND7) U5.P$3(GND)
I2C_SCL: U2.P$9(SCX) U3.10(SCL) U4.4(SCK) U5.P$2(SCL)
I2C_SDA: U2.P$11(SDX) U3.9(SDA) U4.3(SDI) U5.P$6(SDA)
N$7: U3.4(PWM) U3.5(SENSE)
SPI_MISO: U1.P$7(MISO)
SPI_MOSI: U1.P$6(MOSI)
SPI_SCK: U1.P$4(SCLK)
VCC: C1.1 C2.1 C3.1 C4.1 C5.1 C6.1 C7.1 C8.1 C9.1 U1.P$1(VDDIO) U1.P$14(VS) U2.P$3(VDD) U2.P$7(PS) U2.P$13(VDDIO) U3.2(!RESET!) U3.6(VDD) U4.2(CSB) U4.5(SDO) U4.6(VDDIO) U4.8(VDD) U5.P$1(VDD)
Unconnected: U1.P$2(NC) U1.P$3(RESERVED) U1.P$5(RESERVED) U1.P$9(INT2) U1.P$10(RESERVED) U1.P$11(INT1) U1.P$15(NC) U2.P$1(INT2) U2.P$2(DRDYM) U2.P$5(CSB2) U2.P$8(NC) U2.P$10(INT5) U2.P$14(INT3) U2.P$15(INT4) U2.P$16(CSB1) U2.P$18(NC) U2.P$19(INT1) U3.3(!INT!) U3.8(AUX) U5.P$4(LDR) U5.P$5(INT)

### Notes on the sheet
- I2C Address: Accel/Gyro/Mag --> 0x18/0x68/0x10 (SDO1/SDO2/CSB3-> GND/GND/GND)
- I2C Address 0x77
- I2C Address: 0x5A (ADDR-> GND)
- I2C Address: 0x29
- Sensors-1
- Warp revision C
- Authored 2015-2019
  Phillip Stanley-Marbell
  Richard Hopper
- NO WARRANTY. See LICENCE.txt

### Library data of the parts
C1-C9 = SparkFun-Passives:CAP: Capacitor Standard 0603 ceramic capacitor, and 0.1" leaded capacitor.
U1 = ADXL362:ADXL362: ADXL362, Micropower, 3-Axis, ±2 g/±4 g/±8 g Digital Output MEMS Accelerometer.
U2 = BMX055:BMX055: BMX055 Small, versatile 9-axis sensor module (accelerometer, gyro, and magnetometer).
U3 = SparkFun-Sensors:CCS811: AMS CCS811 – I2C Digital Gas Sensor Ultra-Low Power Digital Gas Sensor for Monitoring Indoor Air Quality AMS Product Page <http://ams.com/eng/Products/Environmental-Sensors/Gas-Sensors/CCS811> SparkFun Products:; PROD_ID: IC-13607
U4 = BME680:BME680
U5 = TCS3772:TCS3772: TCS3772 COLOR LIGHT-TO-DIGITAL CONVERTER with PROXIMITY SENSING.

## Module FPGA
Ports: GND(pwr) VCC(pwr) SPI_SCK(io) SPI_MISO(io) SPI_MOSI(io) SPI_CS(io) I2C1_SCL(out) I2C1_SDA(io) I2C2_SCL(out) I2C2_SDA(io) VREG(pwr)
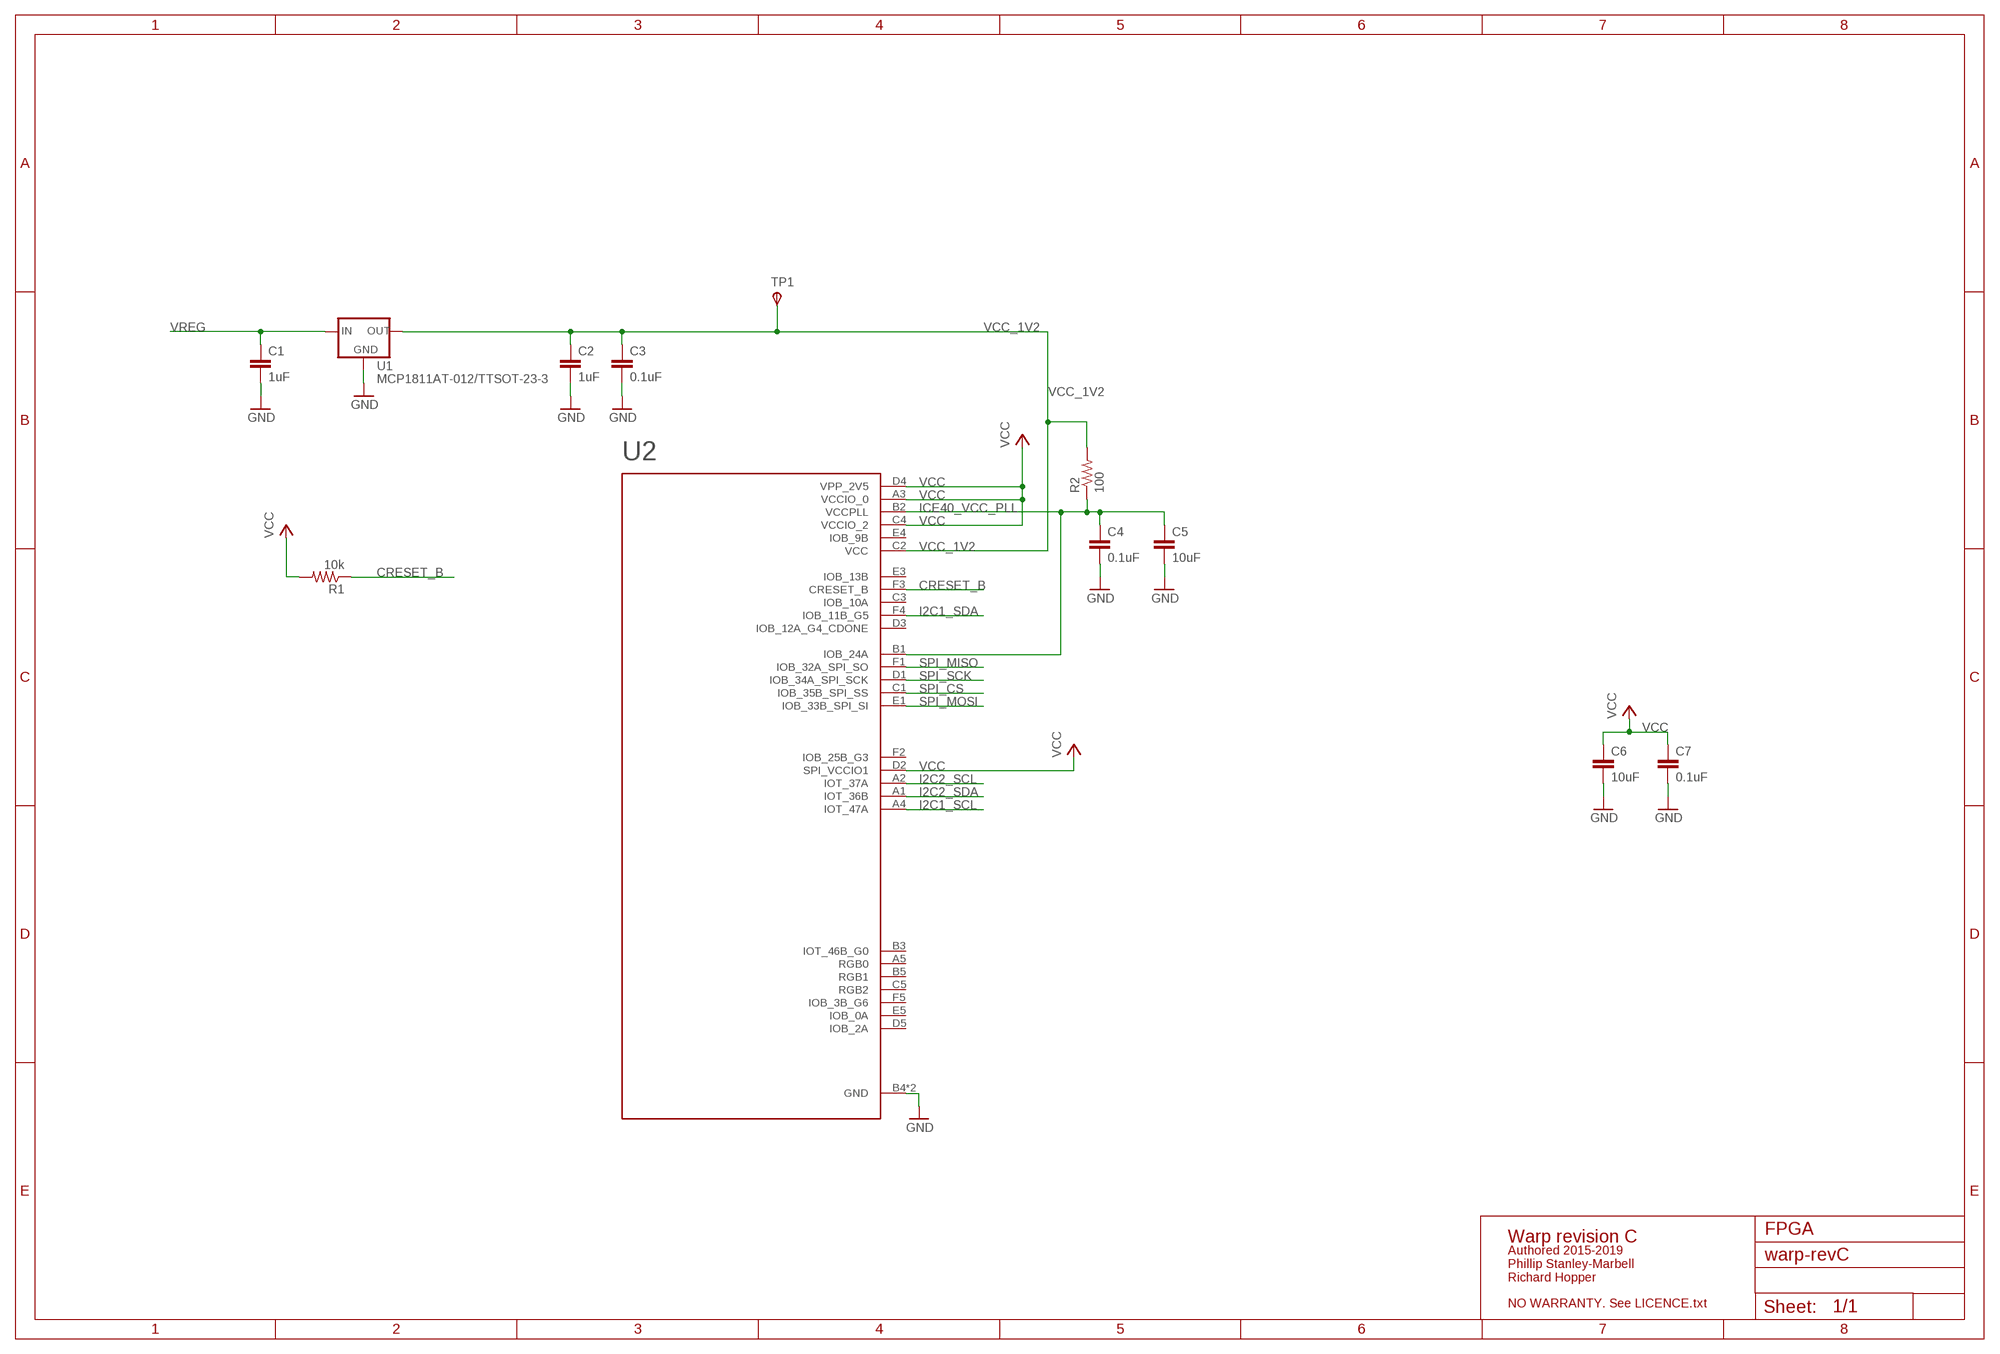
[diagram p7: schematic, module FPGA, sheet 1]

### Parts
C1  1uF  CAP0402-CAP  [0402-CAP]
C2  1uF  CAP0402-CAP  [0402-CAP]
C3  0.1uF  CAP0402-CAP  [0402-CAP]
C4  0.1uF  CAP0402-CAP  [0402-CAP]
C5  10uF  CAP0402-CAP  [0402-CAP]
C6  10uF  CAP0402-CAP  [0402-CAP]
C7  0.1uF  CAP0402-CAP  [0402-CAP]
R1  10k  RESISTOR0402-RES  [0402-RES]
R2  100  RESISTOR0402-RES  [0402-RES]
TP1  TPSTP06R  [TP06R]
U1  MCP1811AT-012/TTSOT-23-3  [SOT23-3]
U2  ICE40UP5K-UWG30  [LATTICE-WLCSP-30]

### Nets
CRESET_B: R1.1 U2.F3(CRESET_B)
GND: C1.2 C2.2 C3.2 C4.2 C5.2 C6.2 C7.2 U1.3(GND) U2.B4(GND) U2.E2(GND)
I2C1_SCL: U2.A4(IOT_47A)
I2C1_SDA: U2.F4(IOB_11B_G5)
I2C2_SCL: U2.A2(IOT_37A)
I2C2_SDA: U2.A1(IOT_36B)
ICE40_VCC_PLL: C4.1 C5.1 R2.1 U2.B1(IOB_24A) U2.B2(VCCPLL)
SPI_CS: U2.C1(IOB_35B_SPI_SS)
SPI_MISO: U2.F1(IOB_32A_SPI_SO)
SPI_MOSI: U2.E1(IOB_33B_SPI_SI)
SPI_SCK: U2.D1(IOB_34A_SPI_SCK)
VCC: C6.1 C7.1 R1.2 U2.A3(VCCIO_0) U2.C4(VCCIO_2) U2.D2(SPI_VCCIO1) U2.D4(VPP_2V5)
VCC_1V2: C2.1 C3.1 R2.2 TP1.TP(PP) U1.1(OUT) U2.C2(VCC)
VREG: C1.1 U1.2(IN)
Unconnected: U2.A5(RGB0) U2.B3(IOT_46B_G0) U2.B5(RGB1) U2.C3(IOB_10A) U2.C5(RGB2) U2.D3(IOB_12A_G4_CDONE) U2.D5(IOB_2A) U2.E3(IOB_13B) U2.E4(IOB_9B) U2.E5(IOB_0A) U2.F2(IOB_25B_G3) U2.F5(IOB_3B_G6)

### Notes on the sheet
- FPGA
- Warp revision C
- Authored 2015-2019
  Phillip Stanley-Marbell
  Richard Hopper
- NO WARRANTY. See LICENCE.txt

### Library data of the parts
C1-C7 = SparkFun-Passives:CAP: Capacitor Standard 0603 ceramic capacitor, and 0.1" leaded capacitor.
R1 R2 = SparkFun-Passives:RESISTOR: Resistor Basic schematic elements and footprints for 0603, 1206, and PTH resistors.
TP1 = testpad:TPS: TEST PIN
U1 = MCP1811AT-012:TT:MCP1811AT-012/TT
U2 = ICE40UP5K:ICE40UP5K-UWG30

## Module SENSORS-2
Ports: GND(pwr) VCC(pwr) I2C_SCL(in) I2C_SDA(io) SI4705_!RST(io) SI4705_RCLK(io)
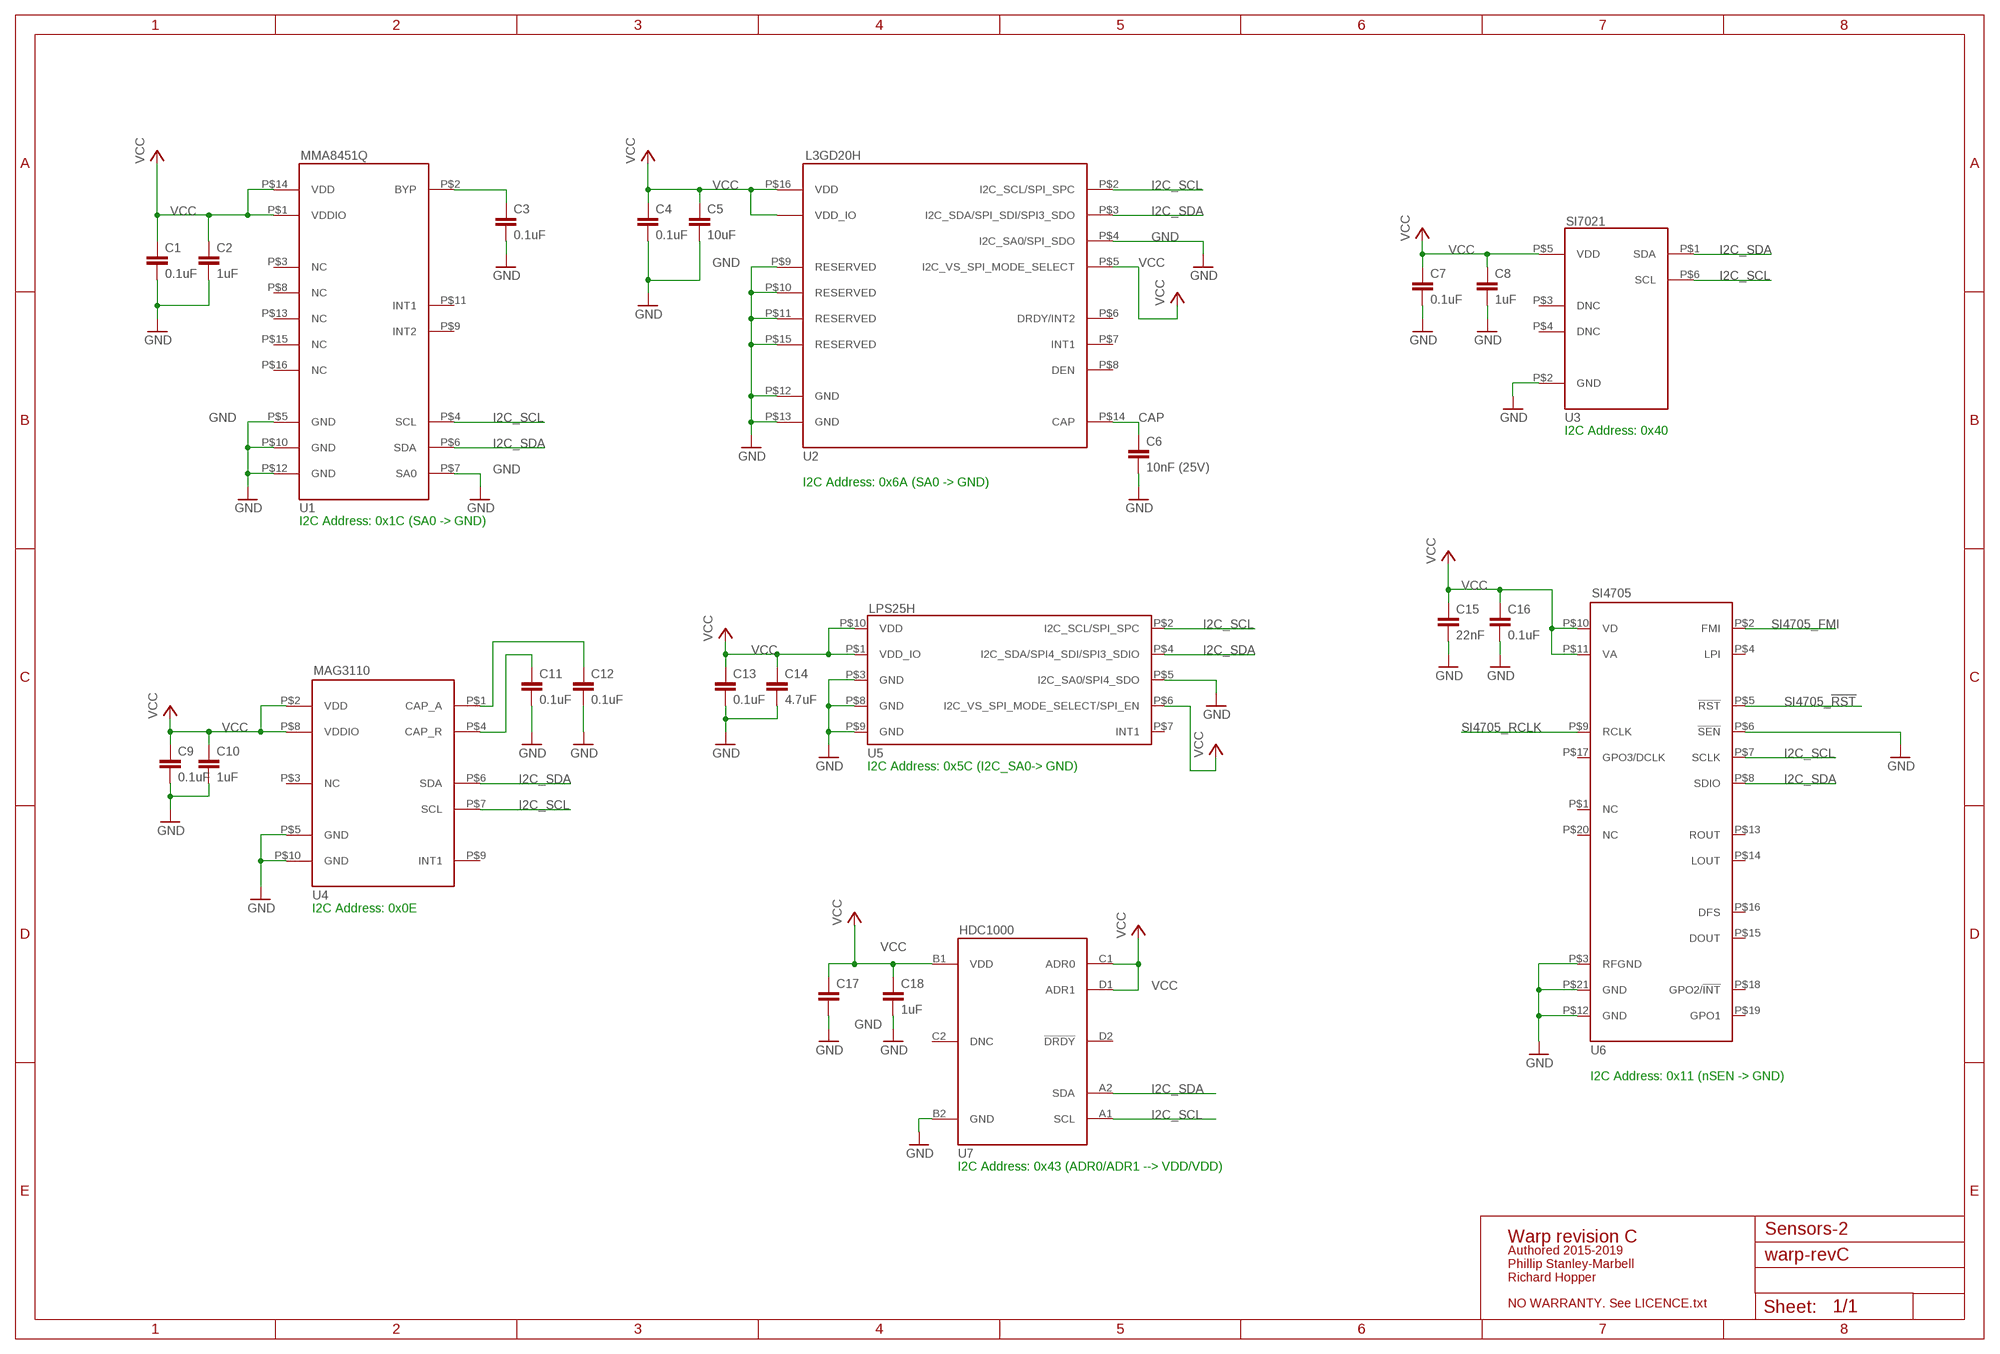
[diagram p8: schematic, module SENSORS-2, sheet 1]

### Parts
C1  0.1uF  CAP0402-CAP  [0402-CAP]
C2  1uF  CAP0402-CAP  [0402-CAP]
C3  0.1uF  CAP0402-CAP  [0402-CAP]
C4  0.1uF  CAP0402-CAP  [0402-CAP]
C5  10uF  CAP0402-CAP  [0402-CAP]
C6  10nF (25V)  CAP0402-CAP  [0402-CAP]
C7  0.1uF  CAP0402-CAP  [0402-CAP]
C8  1uF  CAP0402-CAP  [0402-CAP]
C9  0.1uF  CAP0402-CAP  [0402-CAP]
C10  1uF  CAP0402-CAP  [0402-CAP]
C11  0.1uF  CAP0402-CAP  [0402-CAP]
C12  0.1uF  CAP0402-CAP  [0402-CAP]
C13  0.1uF  CAP0402-CAP  [0402-CAP]
C14  4.7uF  CAP0402-CAP  [0402-CAP]
C15  22nF  CAP0402-CAP  [0402-CAP]
C16  0.1uF  CAP0402-CAP  [0402-CAP]
C17  0.1uF  CAP0402-CAP  [0402-CAP]
C18  1uF  CAP0402-CAP  [0402-CAP]
U1  MMA8451Q  [MMA8451Q]
U2  L3GD20H  [L3GD20H]
U3  SI7021  [SI7021]
U4  MAG3110  [MAG3110]
U5  LPS25H  [LPS25H]
U6  SI4705  [SI4705]
U7  HDC1000  [HDC1000]

### Nets
CAP: C6.1 U2.P$14(CAP)
GND: C1.2 C2.2 C3.2 C4.2 C5.2 C6.2 C7.2 C8.2 C9.2 C10.2 C11.2 C12.2 C13.2 C14.2 C15.2 C16.2 C17.2 C18.2 U1.P$5(GND) U1.P$7(SA0) U1.P$10(GND) U1.P$12(GND) U2.P$4(I2C_SA0/SPI_SDO) U2.P$9(RESERVED) U2.P$10(RESERVED) U2.P$11(RESERVED) U2.P$12(GND) U2.P$13(GND) U2.P$15(RESERVED) U3.P$2(GND) U4.P$5(GND) U4.P$10(GND) U5.P$3(GND) U5.P$5(I2C_SA0/SPI4_SDO) U5.P$8(GND) U5.P$9(GND) U6.P$3(RFGND) U6.P$6(!SEN) U6.P$12(GND) U6.P$21(GND) U7.B2(GND)
I2C_SCL: U1.P$4(SCL) U2.P$2(I2C_SCL/SPI_SPC) U3.P$6(SCL) U4.P$7(SCL) U5.P$2(I2C_SCL/SPI_SPC) U6.P$7(SCLK) U7.A1(SCL)
I2C_SDA: U1.P$6(SDA) U2.P$3(I2C_SDA/SPI_SDI/SPI3_SDO) U3.P$1(SDA) U4.P$6(SDA) U5.P$4(I2C_SDA/SPI4_SDI/SPI3_SDIO) U6.P$8(SDIO) U7.A2(SDA)
N$1: C3.1 U1.P$2(BYP)
N$2: C11.1 U4.P$4(CAP_R)
N$17: C12.1 U4.P$1(CAP_A)
SI4705_!RST: U6.P$5(!RST)
SI4705_FMI: U6.P$2(FMI)
SI4705_RCLK: U6.P$9(RCLK)
VCC: C1.1 C2.1 C4.1 C5.1 C7.1 C8.1 C9.1 C10.1 C13.1 C14.1 C15.1 C16.1 C17.1 C18.1 U1.P$1(VDDIO) U1.P$14(VDD) U2.P$1(VDD_IO) U2.P$5(I2C_VS_SPI_MODE_SELECT) U2.P$16(VDD) U3.P$5(VDD) U4.P$2(VDD) U4.P$8(VDDIO) U5.P$1(VDD_IO) U5.P$6(I2C_VS_SPI_MODE_SELECT/SPI_EN) U5.P$10(VDD) U6.P$10(VD) U6.P$11(VA) U7.B1(VDD) U7.C1(ADR0) U7.D1(ADR1)
Unconnected: U1.P$3(NC) U1.P$8(NC) U1.P$9(INT2) U1.P$11(INT1) U1.P$13(NC) U1.P$15(NC) U1.P$16(NC) U2.P$6(DRDY/INT2) U2.P$7(INT1) U2.P$8(DEN) U3.P$3(DNC) U3.P$4(DNC) U4.P$3(NC) U4.P$9(INT1) U5.P$7(INT1) U6.P$1(NC) U6.P$4(LPI) U6.P$13(ROUT) U6.P$14(LOUT) U6.P$15(DOUT) U6.P$16(DFS) U6.P$17(GPO3/DCLK) U6.P$18(GPO2/!INT) U6.P$19(GPO1) U6.P$20(NC) U7.C2(DNC) U7.D2(!DRDY)

### Notes on the sheet
- I2C Address: 0x40
- I2C Address: 0x6A (SA0 -> GND)
- I2C Address: 0x1C (SA0 -> GND)
- I2C Address: 0x5C (I2C_SA0-> GND)
- I2C Address: 0x0E
- I2C Address: 0x11 (nSEN -> GND)
- I2C Address: 0x43 (ADR0/ADR1 --> VDD/VDD)
- Sensors-2
- Warp revision C
- Authored 2015-2019
  Phillip Stanley-Marbell
  Richard Hopper
- NO WARRANTY. See LICENCE.txt

### Library data of the parts
C1-C18 = SparkFun-Passives:CAP: Capacitor Standard 0603 ceramic capacitor, and 0.1" leaded capacitor.
U1 = MMA8451Q:MMA8451Q: MMA8451Q 3-Axis, 14-bit/8-bit Digital Accelerometer.
U2 = L3GD20H:L3GD20H: L3GD20H MEMS motion sensor: three-axis digital output gyroscope.
U3 = SI7021:SI7021: I2C HUMIDITY AND TEMPERATURE SENSOR.
U4 = MAG3110:MAG3110: MAG3110 Three-Axis, Digital Magnetometer.
U5 = LPS25H:LPS25H: LPS25H MEMS pressure sensor: 260-1260 hPa absolute digital output barometer
U6 = SI4705:SI4705: Si4705 BROADCAST FM RADIO RECEIVER FOR CONSUMER ELECTRONICS.
U7 = HDC1000:HDC1000: HDC1000 Low Power, High Accuracy Digital Humidity Sensor with Temperature Sensor.

## Module RTC
Ports: GND(pwr) I2C_SCL(in) I2C_SDA(io) VCC(pwr) !INT(out)
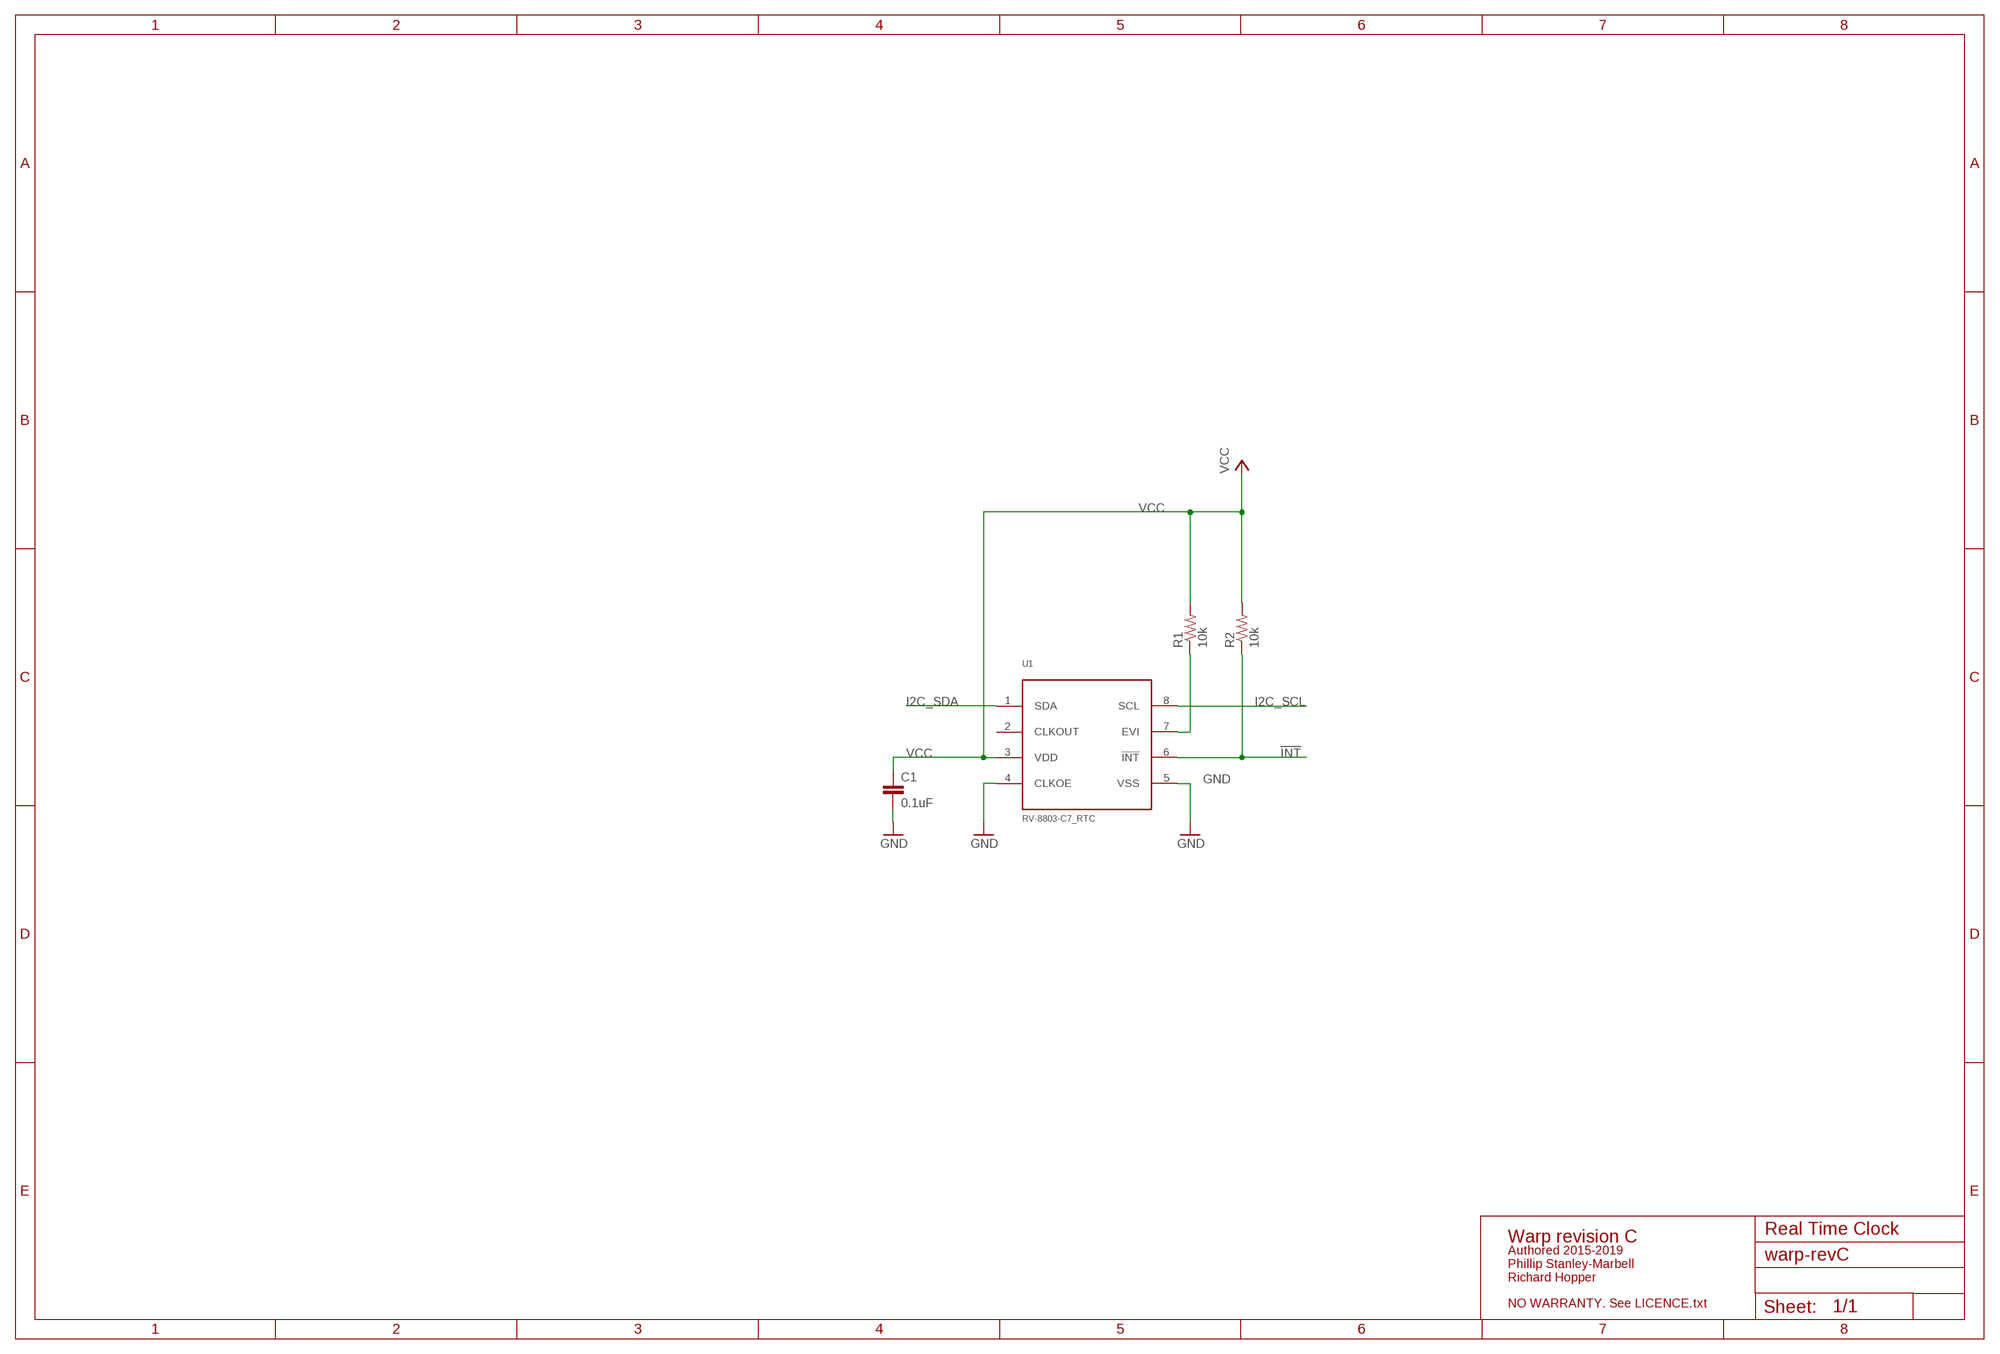
[diagram p9: schematic, module RTC, sheet 1]

### Parts
C1  0.1uF  CAP0603-CAP  [0603-CAP]
R1  10k  RESISTOR0402-RES  [0402-RES]
R2  10k  RESISTOR0402-RES  [0402-RES]
U1  RV-8803-C7_RTC  [RV-C7]

### Nets
!INT: R2.1 U1.6(!INT!)
GND: C1.2 U1.4(CLKOE) U1.5(VSS)
I2C_SCL: U1.8(SCL)
I2C_SDA: U1.1(SDA)
N$3: R1.1 U1.7(EVI)
VCC: C1.1 R1.2 R2.2 U1.3(VDD)
Unconnected: U1.2(CLKOUT)

### Notes on the sheet
- Real Time Clock
- Warp revision C
- Authored 2015-2019
  Phillip Stanley-Marbell
  Richard Hopper
- NO WARRANTY. See LICENCE.txt

### Library data of the parts
C1 = SparkFun-Passives:CAP: Capacitor Standard 0603 ceramic capacitor, and 0.1" leaded capacitor.
R1 R2 = SparkFun-Passives:RESISTOR: Resistor Basic schematic elements and footprints for 0603, 1206, and PTH resistors.
U1 = Micro Crystal RTC:RV-8803-C7_RTC

## Module CHARGER
Ports: GND(pwr) IN(pwr) OUT(out) BAT(pwr)
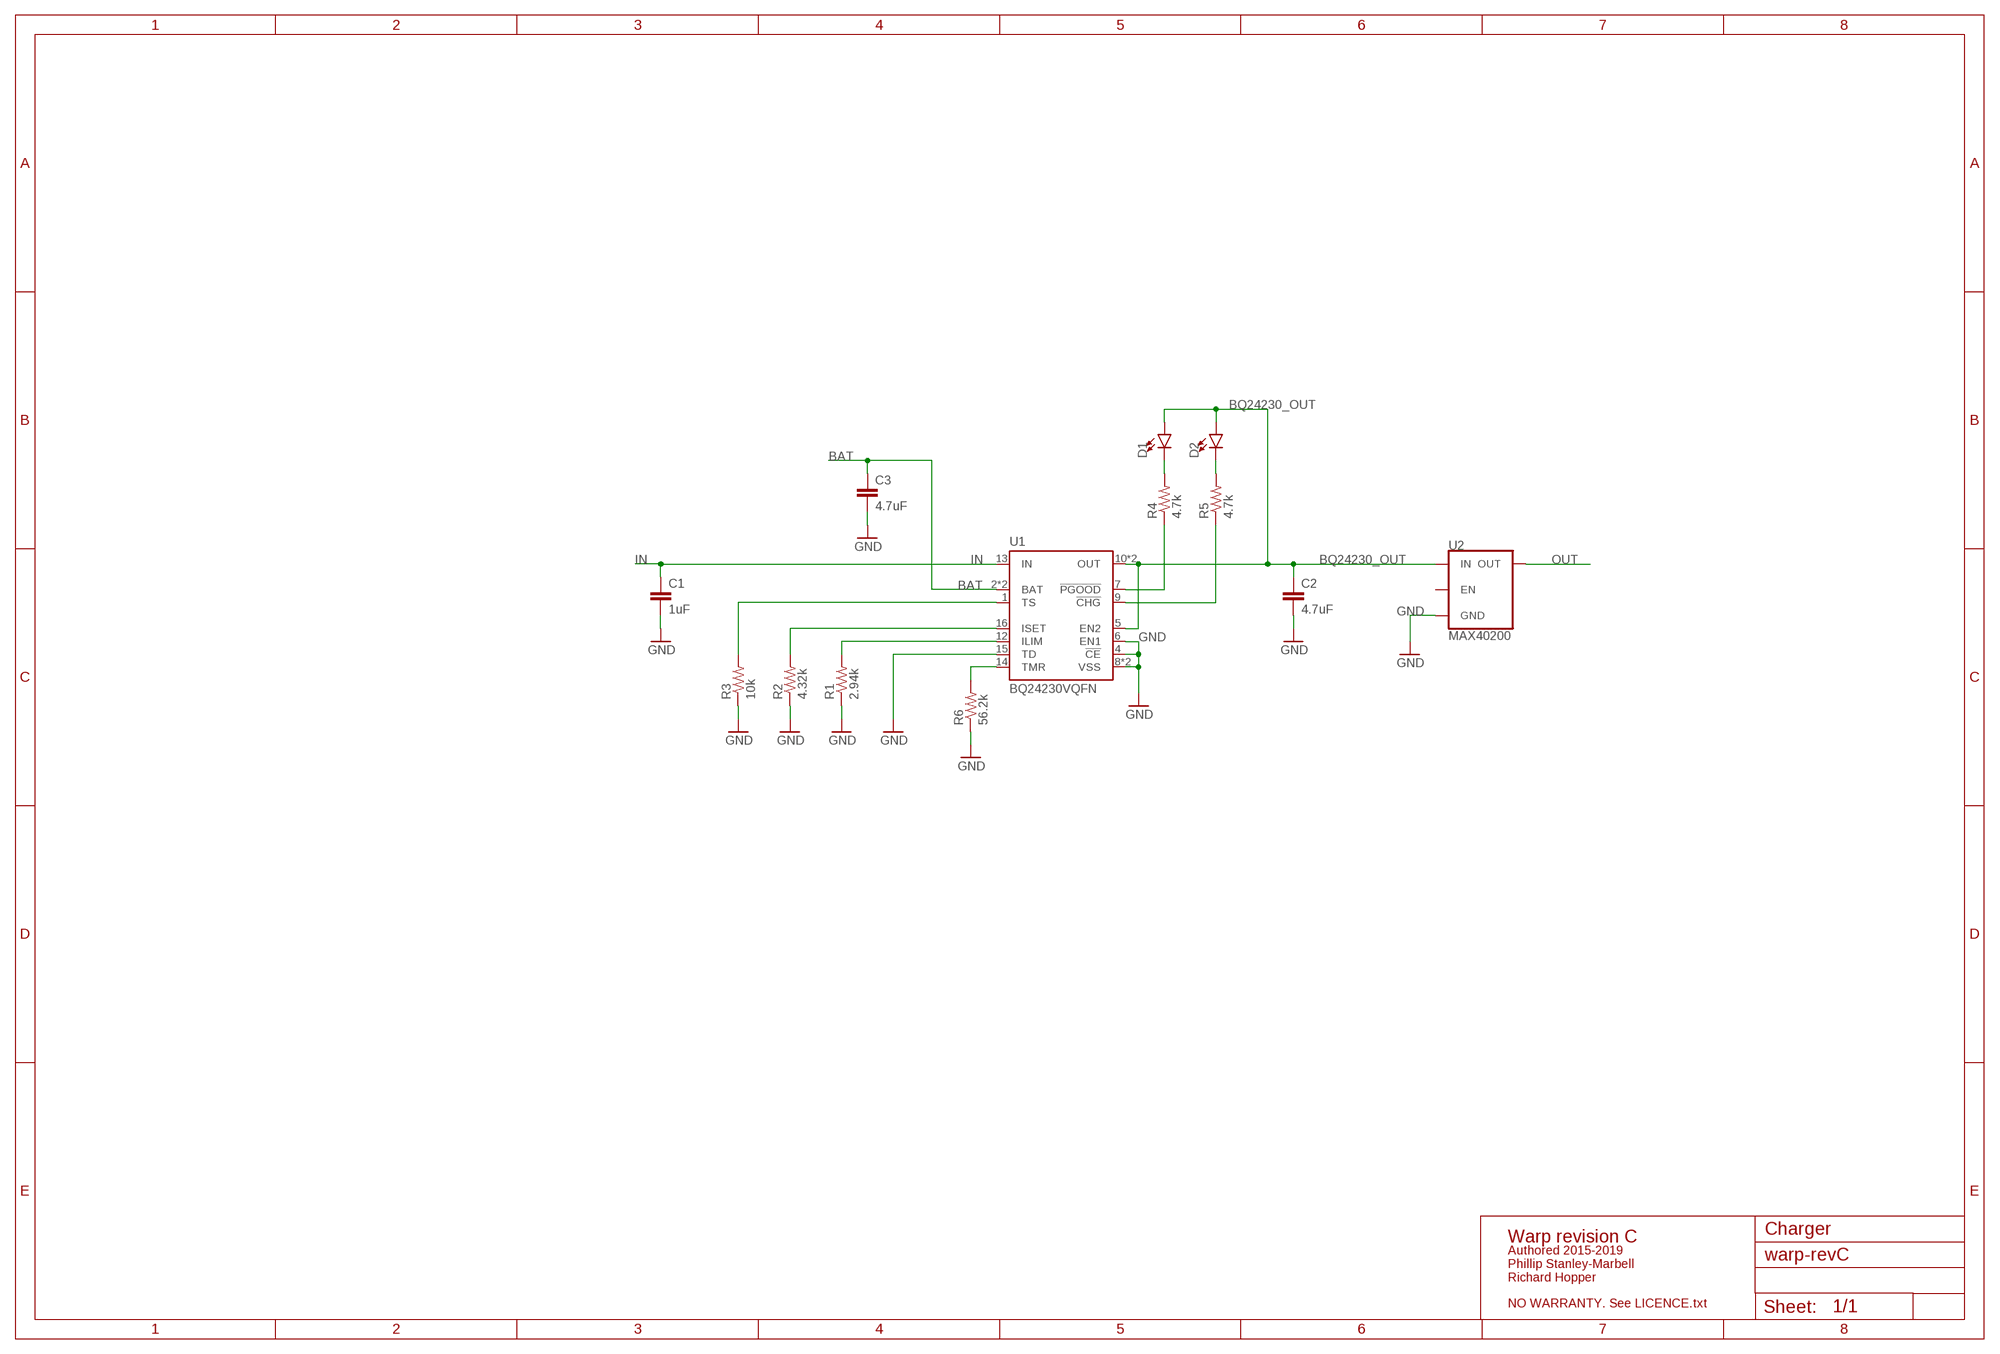
[diagram p10: schematic, module CHARGER, sheet 1]

### Parts
C1  1uF  CAP0805  [0805]
C2  4.7uF  CAP0805  [0805]
C3  4.7uF  CAP0805  [0805]
D1  LED0603  [LED-0603]
D2  LED0603  [LED-0603]
R1  2.94k  RESISTOR0402-RES  [0402-RES]
R2  4.32k  RESISTOR0402-RES  [0402-RES]
R3  10k  RESISTOR0402-RES  [0402-RES]
R4  4.7k  RESISTOR0402-RES  [0402-RES]
R5  4.7k  RESISTOR0402-RES  [0402-RES]
R6  56.2k  RESISTOR0402-RES  [0402-RES]
U1  BQ24230VQFN  [PVQFN-N16]
U2  MAX40200  [DSBGA]

### Nets
BAT: C3.1 U1.2(BAT) U1.3(BAT)
BQ24230_OUT: C2.1 D1.A D2.A U1.5(EN2) U1.10(OUT) U1.11(OUT) U2.A1(IN)
GND: C1.2 C2.2 C3.2 R1.1 R2.1 R3.1 R6.1 U1.4(!CE!) U1.6(EN1) U1.8(VSS) U1.15(TD) U1.EP(VSS) U2.B2(GND)
IN: C1.1 U1.13(IN)
N$1: R2.2 U1.16(ISET)
N$2: R1.2 U1.12(ILIM)
N$3: R4.1 U1.7(!PGOOD!)
N$4: R3.2 U1.1(TS)
N$5: R5.1 U1.9(!CHG!)
N$6: D1.C R4.2
N$7: D2.C R5.2
N$8: R6.2 U1.14(TMR)
OUT: U2.A2(OUT)
Unconnected: U2.B1(EN)

### Notes on the sheet
- Charger
- Warp revision C
- Authored 2015-2019
  Phillip Stanley-Marbell
  Richard Hopper
- NO WARRANTY. See LICENCE.txt

### Library data of the parts
C1-C3 = SparkFun-Passives:CAP: Capacitor Standard 0603 ceramic capacitor, and 0.1" leaded capacitor.
D1 D2 = SparkFun-LED:LED: LED (Generic) Standard schematic elements and footprints for 5mm, 3mm, 1206, and 0603 sized LEDs. Generic LEDs with no color specified.
R1-R6 = SparkFun-Passives:RESISTOR: Resistor Basic schematic elements and footprints for 0603, 1206, and PTH resistors.
U1 = BQ24230:BQ24230: bq2423x USB-Friendly Lithium-Ion Battery Charger And Power-Path Management IC
U2 = MAX40200:MAX40200

## Module USB
Ports: GND(pwr) +5V(io)
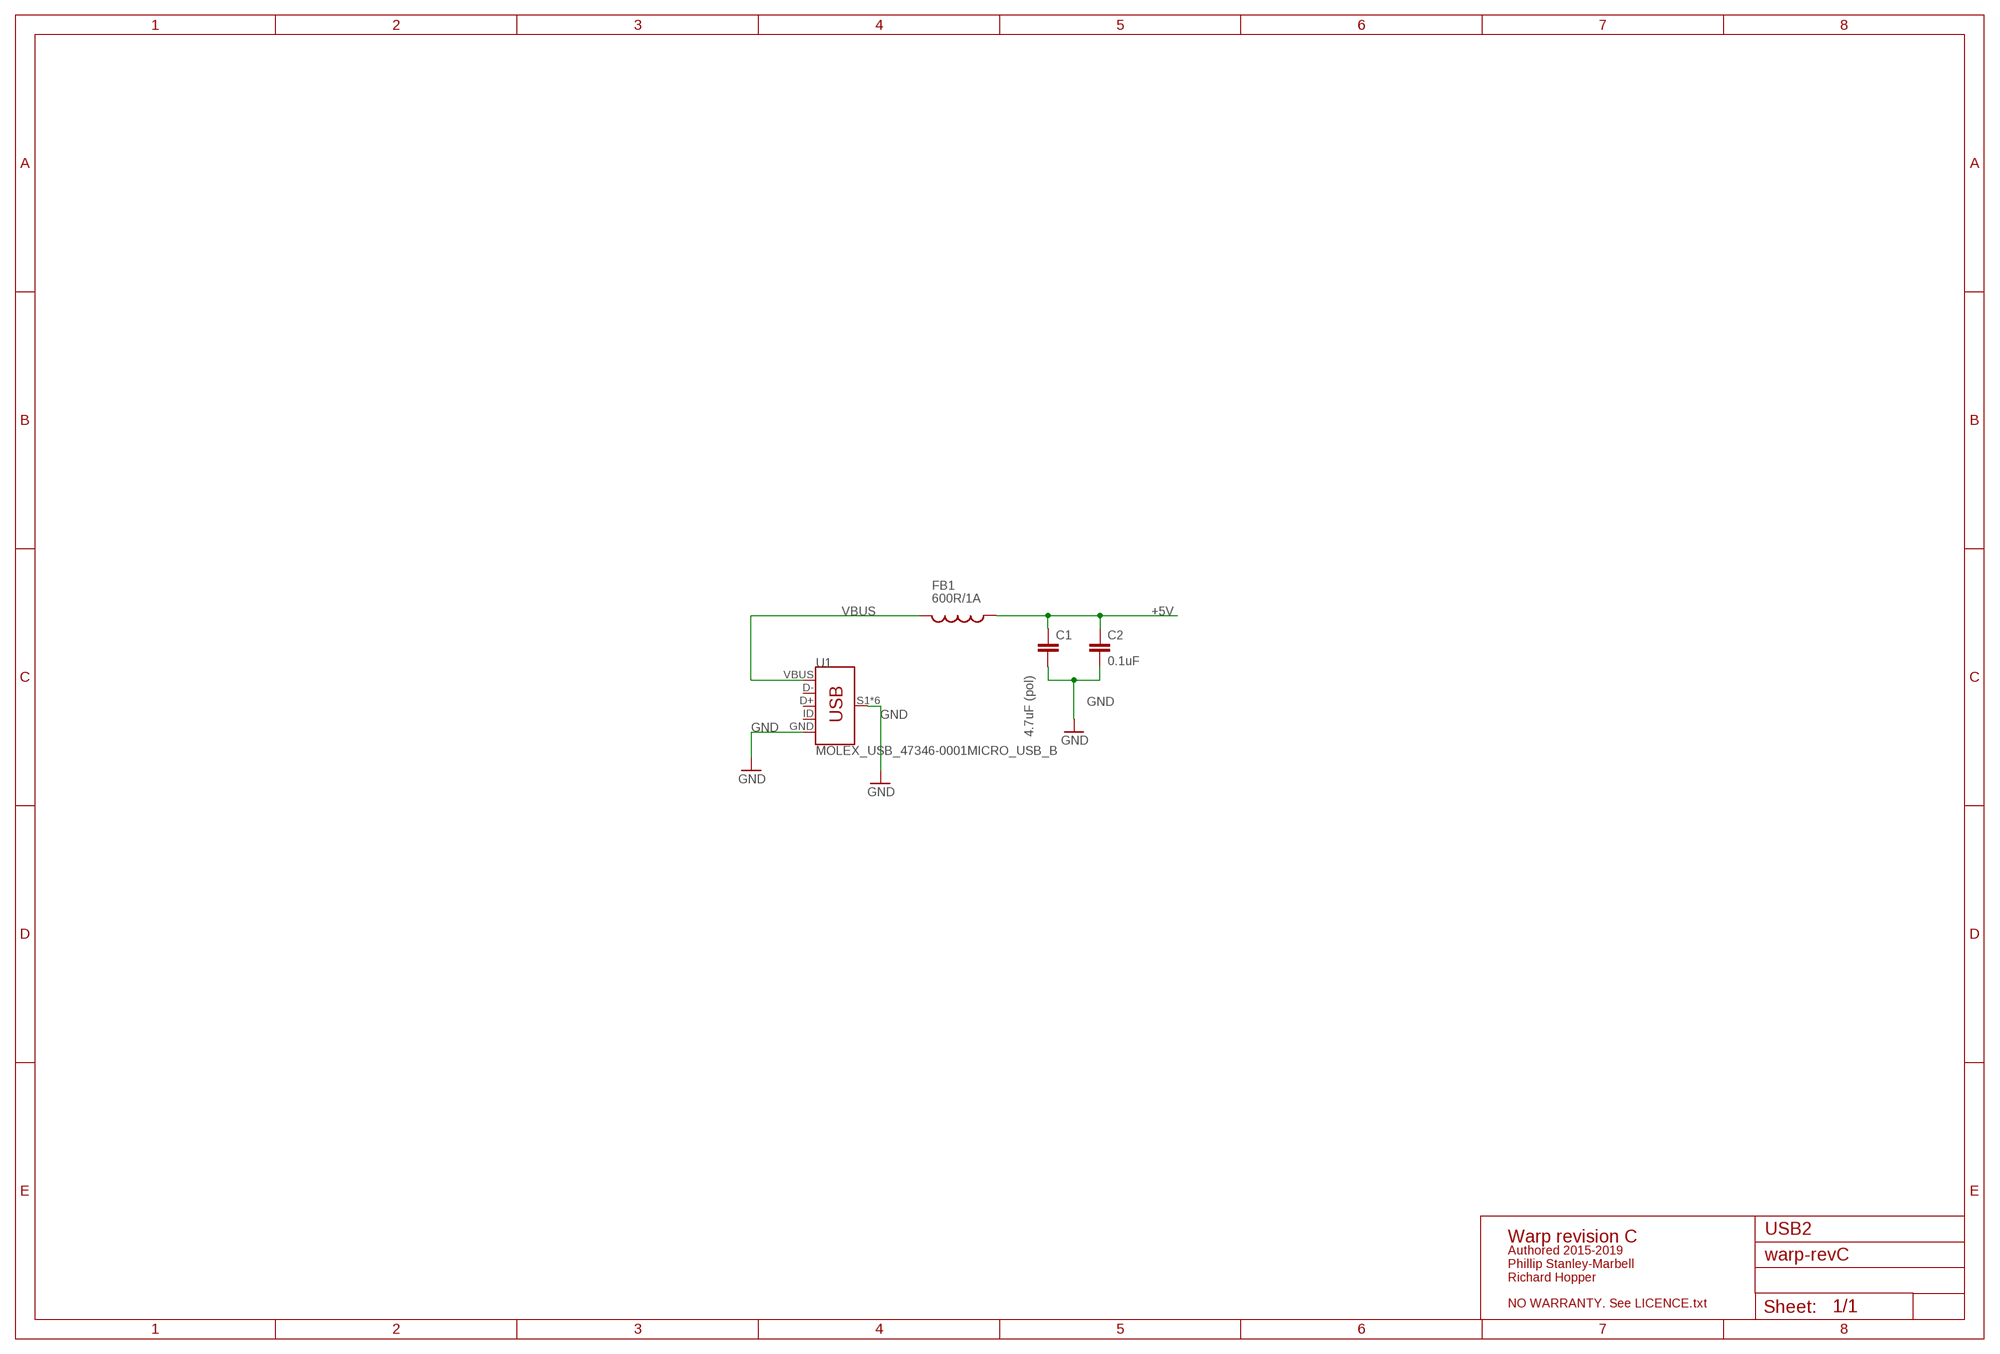
[diagram p11: schematic, module USB, sheet 1]

### Parts
C1  4.7uF (pol)  CAP0402-CAP  [0402-CAP]
C2  0.1uF  CAP0402-CAP  [0402-CAP]
FB1  600R/1A  INDUCTOR0603  [0603]
U1  MOLEX_USB_47346-0001MICRO_USB_B  [USB-B-MICRO-SMD]

### Nets
+5V: C1.1 C2.1 FB1.1
GND: C1.2 C2.2 U1.GND U1.S1(SHIELD) U1.S2(SHIELD) U1.S3(SHIELD) U1.S4(SHIELD) U1.S5(SHIELD) U1.S6(SHIELD)
VBUS: FB1.2 U1.VBUS
Unconnected: U1.D+ U1.D- U1.ID

### Notes on the sheet
- USB2
- Warp revision C
- Authored 2015-2019
  Phillip Stanley-Marbell
  Richard Hopper
- NO WARRANTY. See LICENCE.txt

### Library data of the parts
C1 C2 = SparkFun-Passives:CAP: Capacitor Standard 0603 ceramic capacitor, and 0.1" leaded capacitor.
FB1 = SparkFun-Passives:INDUCTOR: Inductors Basic Inductor/Choke - 0603 and 1206. Footprints are not proven and vary greatly between part numbers.
U1 = MOLEX MICRO USB:MOLEX_USB_47346-0001

## Module DIGIPOT
Ports: SPI_SCK(in) SPI_MISO(out) SPI_MOSI(in) VCC(pwr) GND(pwr) DCP_RW1(io) DCP_RW2(io) DCP_RW3(io) DCP_RW4(io) SPI_CS(io)
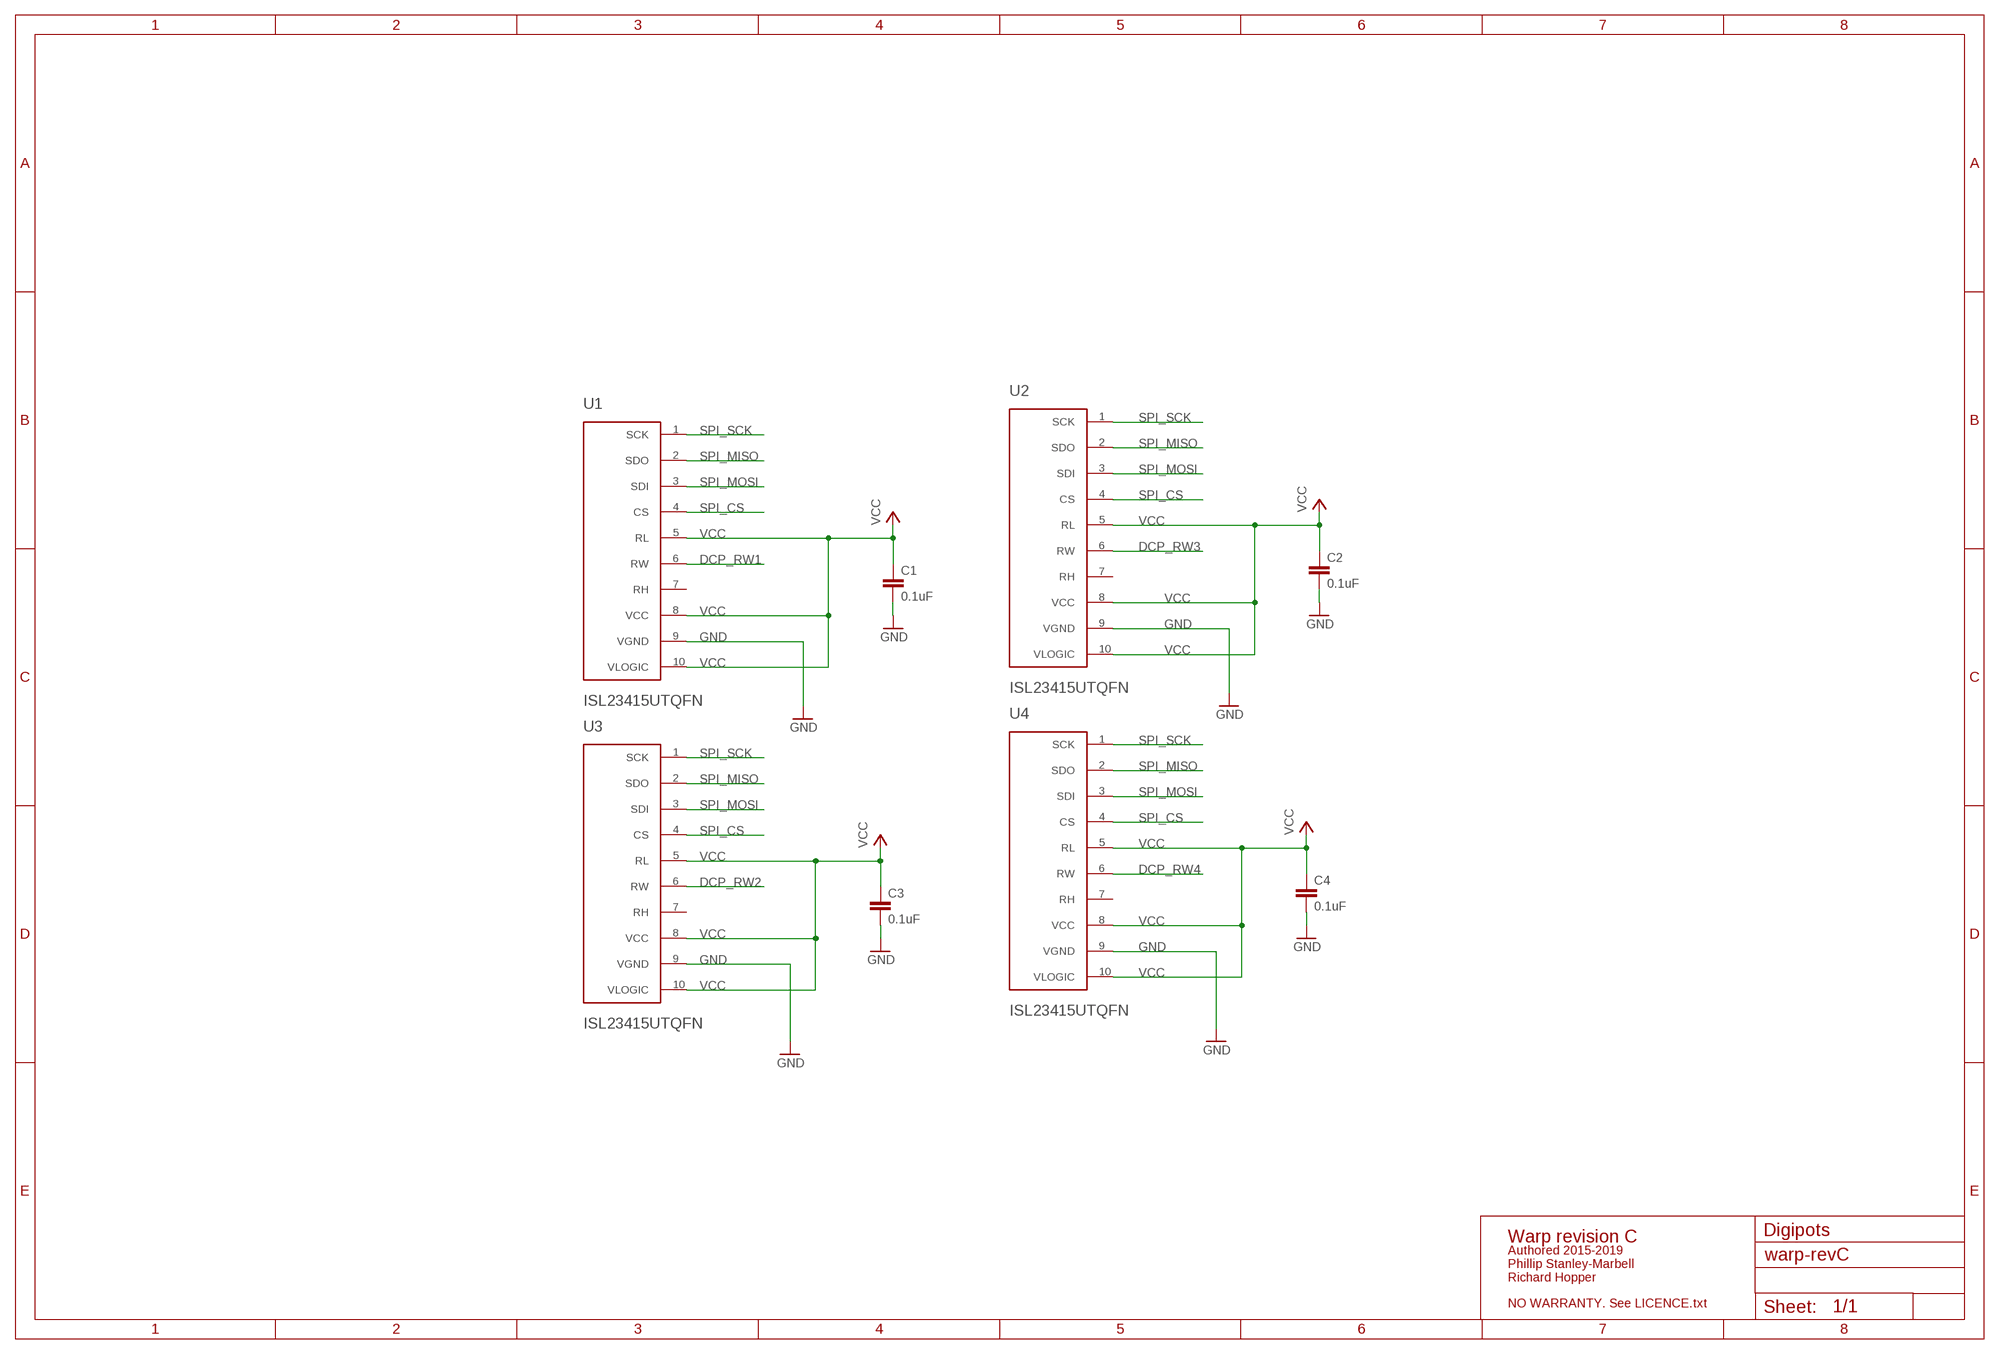
[diagram p12: schematic, module DIGIPOT, sheet 1]

### Parts
C1  0.1uF  CAP0402-CAP  [0402-CAP]
C2  0.1uF  CAP0402-CAP  [0402-CAP]
C3  0.1uF  CAP0402-CAP  [0402-CAP]
C4  0.1uF  CAP0402-CAP  [0402-CAP]
U1  ISL23415UTQFN  [ISL23415]
U2  ISL23415UTQFN  [ISL23415]
U3  ISL23415UTQFN  [ISL23415]
U4  ISL23415UTQFN  [ISL23415]

### Nets
DCP_RW1: U1.6(RW)
DCP_RW2: U3.6(RW)
DCP_RW3: U2.6(RW)
DCP_RW4: U4.6(RW)
GND: C1.2 C2.2 C3.2 C4.2 U1.9(VGND) U2.9(VGND) U3.9(VGND) U4.9(VGND)
SPI_CS: U1.4(CS) U2.4(CS) U3.4(CS) U4.4(CS)
SPI_MISO: U1.2(SDO) U2.2(SDO) U3.2(SDO) U4.2(SDO)
SPI_MOSI: U1.3(SDI) U2.3(SDI) U3.3(SDI) U4.3(SDI)
SPI_SCK: U1.1(SCK) U2.1(SCK) U3.1(SCK) U4.1(SCK)
VCC: C1.1 C2.1 C3.1 C4.1 U1.5(RL) U1.8(VCC) U1.10(VLOGIC) U2.5(RL) U2.8(VCC) U2.10(VLOGIC) U3.5(RL) U3.8(VCC) U3.10(VLOGIC) U4.5(RL) U4.8(VCC) U4.10(VLOGIC)
Unconnected: U1.7(RH) U2.7(RH) U3.7(RH) U4.7(RH)

### Notes on the sheet
- Digipots
- Warp revision C
- Authored 2015-2019
  Phillip Stanley-Marbell
  Richard Hopper
- NO WARRANTY. See LICENCE.txt

### Library data of the parts
C1-C4 = SparkFun-Passives:CAP: Capacitor Standard 0603 ceramic capacitor, and 0.1" leaded capacitor.
U1-U4 = ISL23415:ISL23415